# EAGLE design quad (EAGLE 8.3.2)

## Sheet 1 of 7
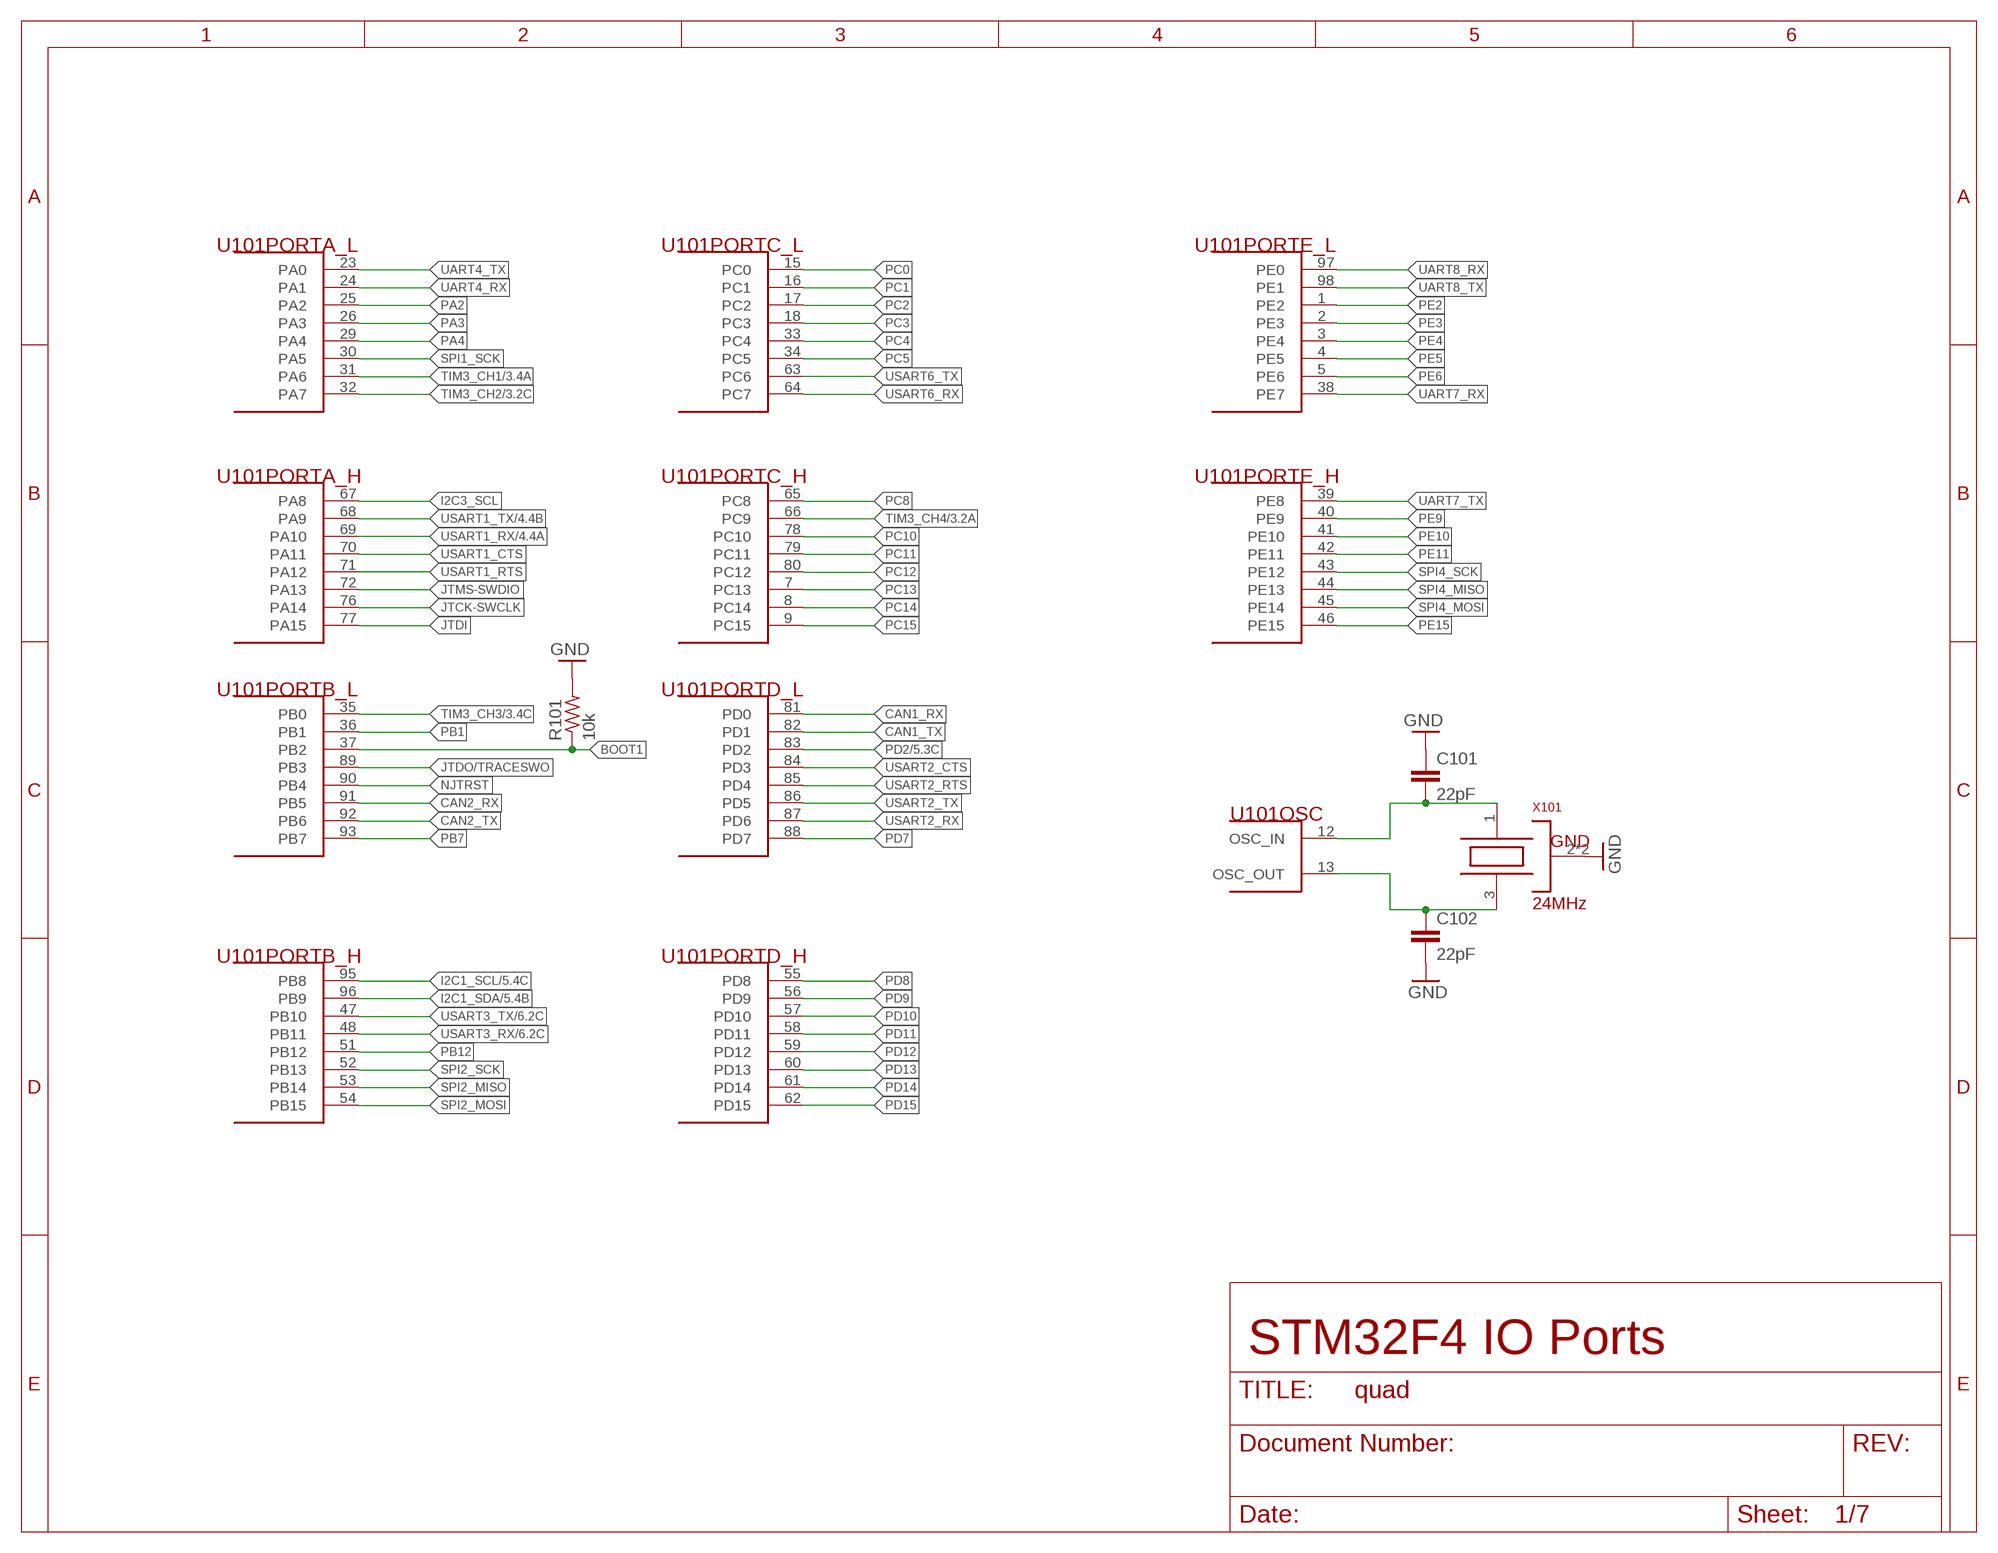
[diagram p0: schematic, sheet 1]

### Parts
C101  22pF  C-EUC0603  [C0603]
C102  22pF  C-EUC0603  [C0603]
R101  10k  R-US_R0603  [R0603]
U101  STM32F427VGT6  [LQFP-100]
X101  24MHz  OSCILLATOR  [OSC3.2X2.5]

### Nets
BOOT1: R101.1 U101.37(PORTB_L:PB2)
CAN1_RX: U101.81(PORTD_L:PD0)
CAN1_TX: U101.82(PORTD_L:PD1)
CAN2_RX: U101.91(PORTB_L:PB5)
CAN2_TX: U101.92(PORTB_L:PB6)
GND: C101.1 C102.2 R101.2 X101.2(GND) X101.4(GND) ; also sheet 2,3,4,5,6,7
I2C1_SCL: U101.95(PORTB_H:PB8) ; also sheet 5
I2C1_SDA: U101.96(PORTB_H:PB9) ; also sheet 5
I2C3_SCL: U101.67(PORTA_H:PA8)
JTCK-SWCLK: U101.76(PORTA_H:PA14)
JTDI: U101.77(PORTA_H:PA15)
JTDO/TRACESWO: U101.89(PORTB_L:PB3)
JTMS-SWDIO: U101.72(PORTA_H:PA13)
NJTRST: U101.90(PORTB_L:PB4)
OSC_IN: C101.2 U101.12(OSC:OSC_IN) X101.1(OSC1)
OSC_OUT: C102.1 U101.13(OSC:OSC_OUT) X101.3(OSC2)
PA2: U101.25(PORTA_L:PA2)
PA3: U101.26(PORTA_L:PA3)
PA4: U101.29(PORTA_L:PA4)
PB1: U101.36(PORTB_L:PB1)
PB7: U101.93(PORTB_L:PB7)
PB12: U101.51(PORTB_H:PB12)
PC0: U101.15(PORTC_L:PC0)
PC1: U101.16(PORTC_L:PC1)
PC2: U101.17(PORTC_L:PC2)
PC3: U101.18(PORTC_L:PC3)
PC4: U101.33(PORTC_L:PC4)
PC5: U101.34(PORTC_L:PC5)
PC8: U101.65(PORTC_H:PC8)
PC10: U101.78(PORTC_H:PC10)
PC11: U101.79(PORTC_H:PC11)
PC12: U101.80(PORTC_H:PC12)
PC13: U101.7(PORTC_H:PC13)
PC14: U101.8(PORTC_H:PC14)
PC15: U101.9(PORTC_H:PC15)
PD2: U101.83(PORTD_L:PD2) ; also sheet 5
PD7: U101.88(PORTD_L:PD7)
PD8: U101.55(PORTD_H:PD8)
PD9: U101.56(PORTD_H:PD9)
PD10: U101.57(PORTD_H:PD10)
PD11: U101.58(PORTD_H:PD11)
PD12: U101.59(PORTD_H:PD12)
PD13: U101.60(PORTD_H:PD13)
PD14: U101.61(PORTD_H:PD14)
PD15: U101.62(PORTD_H:PD15)
PE2: U101.1(PORTE_L:PE2)
PE3: U101.2(PORTE_L:PE3)
PE4: U101.3(PORTE_L:PE4)
PE5: U101.4(PORTE_L:PE5)
PE6: U101.5(PORTE_L:PE6)
PE9: U101.40(PORTE_H:PE9)
PE10: U101.41(PORTE_H:PE10)
PE11: U101.42(PORTE_H:PE11)
PE15: U101.46(PORTE_H:PE15)
SPI1_SCK: U101.30(PORTA_L:PA5)
SPI2_MISO: U101.53(PORTB_H:PB14)
SPI2_MOSI: U101.54(PORTB_H:PB15)
SPI2_SCK: U101.52(PORTB_H:PB13)
SPI4_MISO: U101.44(PORTE_H:PE13)
SPI4_MOSI: U101.45(PORTE_H:PE14)
SPI4_SCK: U101.43(PORTE_H:PE12)
TIM3_CH1: U101.31(PORTA_L:PA6) ; also sheet 3
TIM3_CH2: U101.32(PORTA_L:PA7) ; also sheet 3
TIM3_CH3: U101.35(PORTB_L:PB0) ; also sheet 3
TIM3_CH4: U101.66(PORTC_H:PC9) ; also sheet 3
UART4_RX: U101.24(PORTA_L:PA1)
UART4_TX: U101.23(PORTA_L:PA0)
UART7_RX: U101.38(PORTE_L:PE7)
UART7_TX: U101.39(PORTE_H:PE8)
UART8_RX: U101.97(PORTE_L:PE0)
UART8_TX: U101.98(PORTE_L:PE1)
USART1_CTS: U101.70(PORTA_H:PA11)
USART1_RTS: U101.71(PORTA_H:PA12)
USART1_RX: U101.69(PORTA_H:PA10) ; also sheet 4
USART1_TX: U101.68(PORTA_H:PA9) ; also sheet 4
USART2_CTS: U101.84(PORTD_L:PD3)
USART2_RTS: U101.85(PORTD_L:PD4)
USART2_RX: U101.87(PORTD_L:PD6)
USART2_TX: U101.86(PORTD_L:PD5)
USART3_RX: U101.48(PORTB_H:PB11) ; also sheet 6
USART3_TX: U101.47(PORTB_H:PB10) ; also sheet 6
USART6_RX: U101.64(PORTC_L:PC7)
USART6_TX: U101.63(PORTC_L:PC6)

### Notes on the sheet
- STM32F4 IO Ports

## Sheet 2 of 7
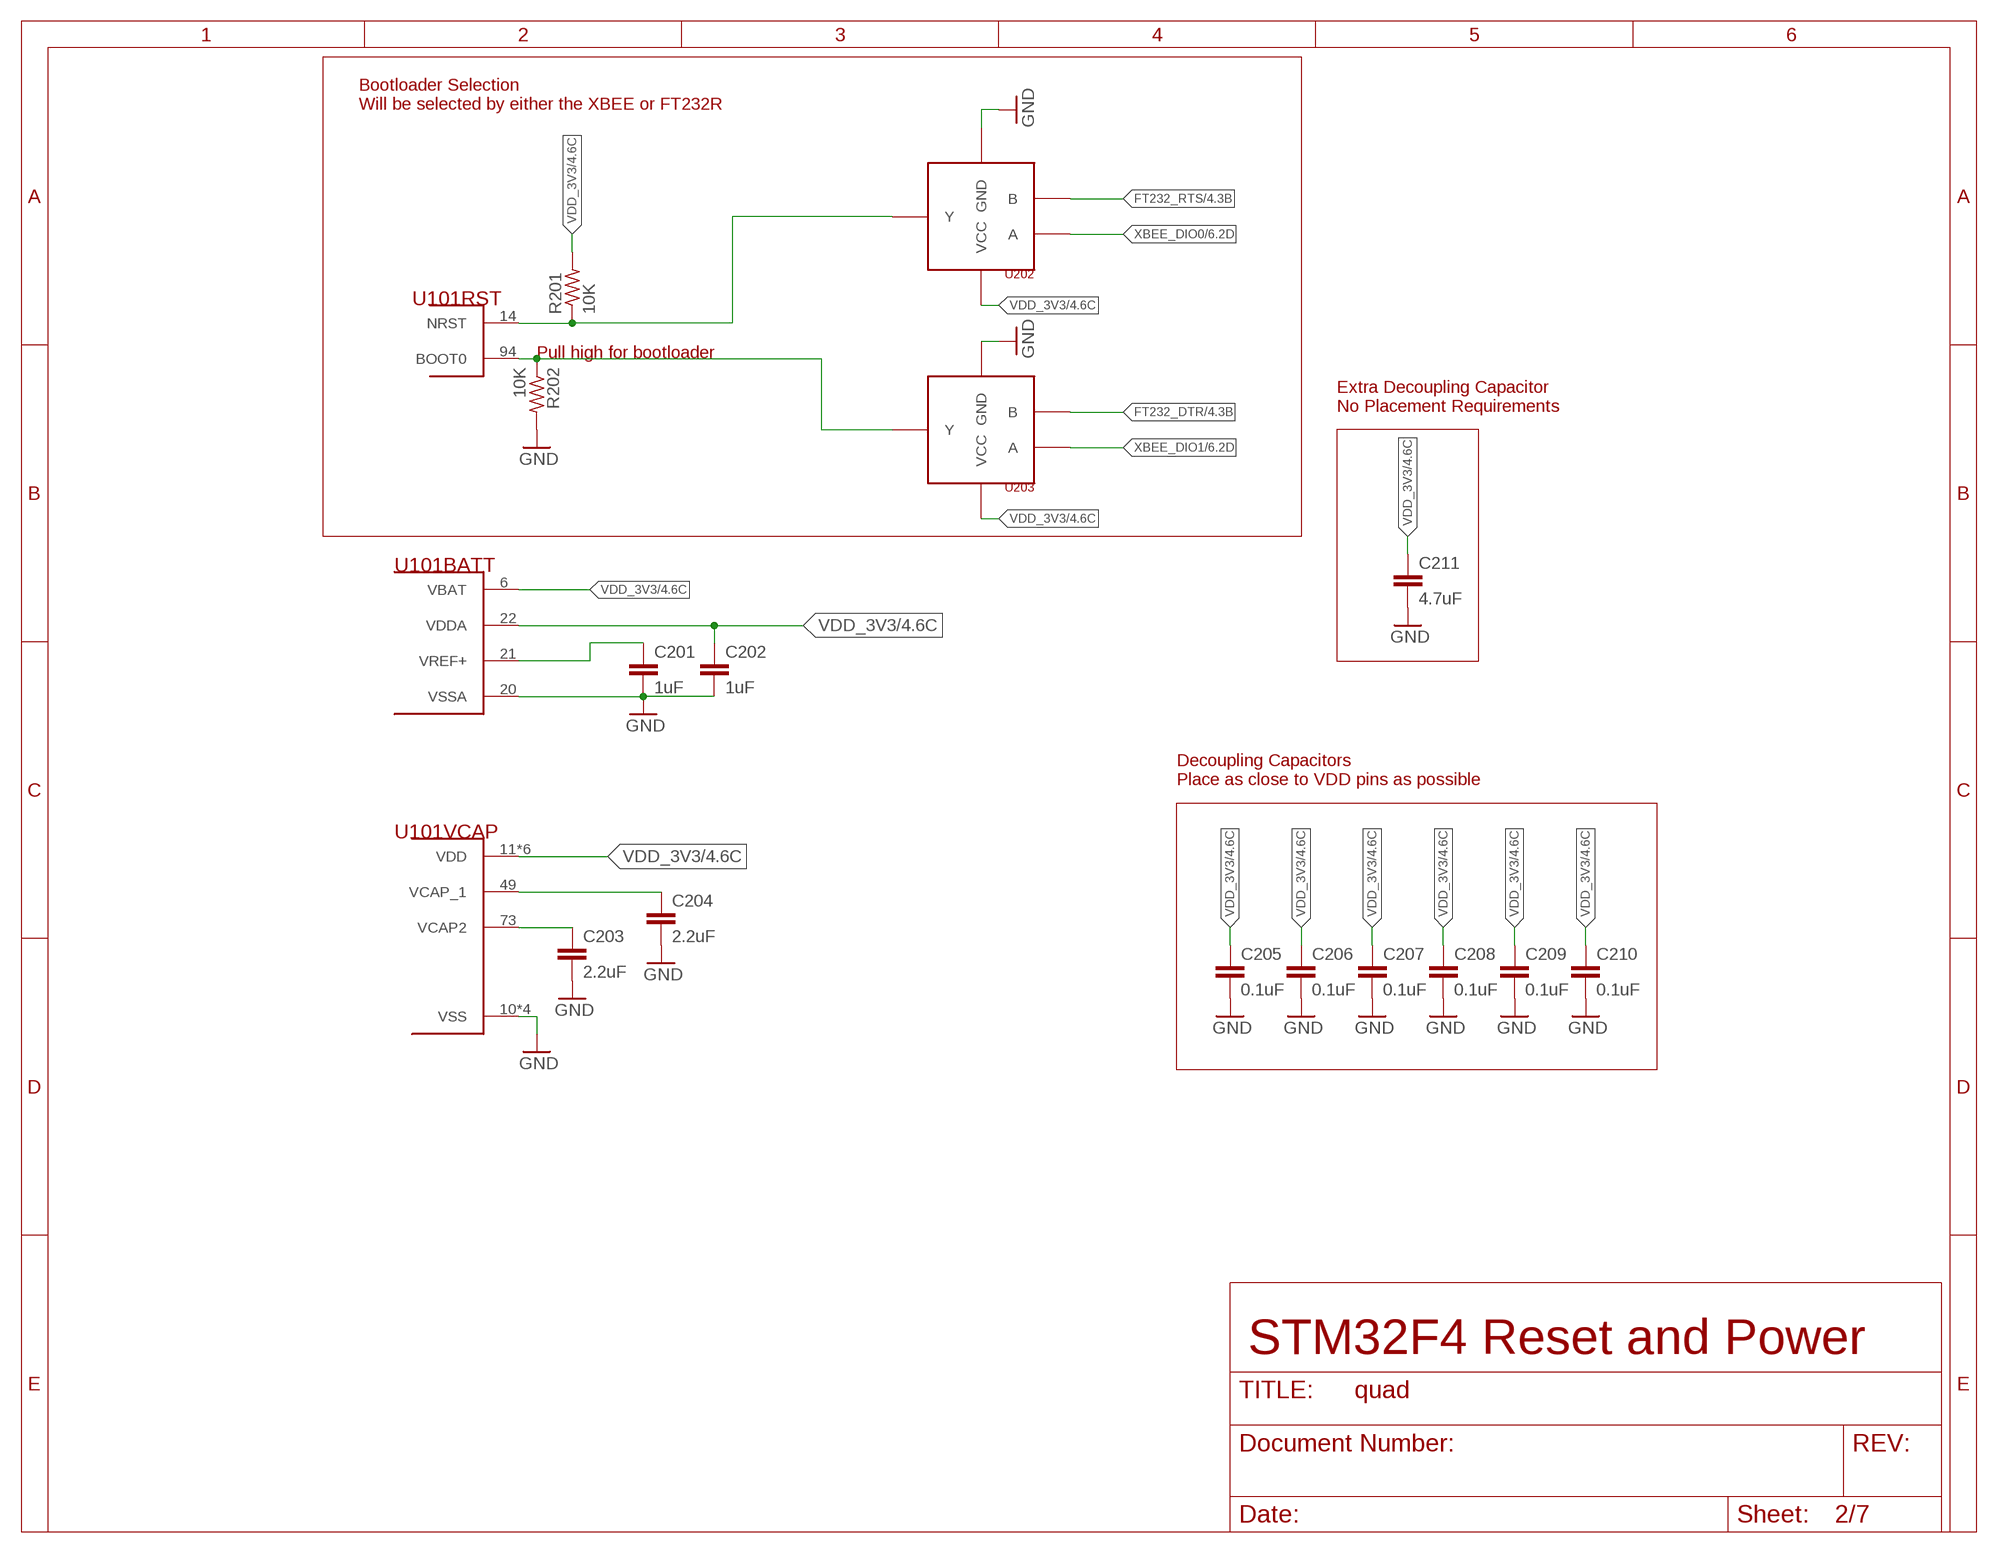
[diagram p1: schematic, sheet 2]

### Parts
C201  1uF  C-EUC0603  [C0603]
C202  1uF  C-EUC0603  [C0603]
C203  2.2uF  C-EUC0603  [C0603]
C204  2.2uF  C-EUC0603  [C0603]
C205  0.1uF  C-EUC0603  [C0603]
C206  0.1uF  C-EUC0603  [C0603]
C207  0.1uF  C-EUC0603  [C0603]
C208  0.1uF  C-EUC0603  [C0603]
C209  0.1uF  C-EUC0603  [C0603]
C210  0.1uF  C-EUC0603  [C0603]
C211  4.7uF  C-EUC0603  [C0603]
R201  10K  R-US_R0603  [R0603]
R202  10K  R-US_R0603  [R0603]
U202  AND_GATE  [SOT23-5L]
U203  SN74AHC1G32DBVR  [SOT23-5L]

### Nets
BOOT0: R202.1 U101.94(RST:BOOT0) U203.4(Y)
FT232_DTR: U203.2(B) ; also sheet 4
FT232_RTS: U202.2(B) ; also sheet 4
GND: C201.2 C202.2 C203.2 C204.2 C205.2 C206.2 C207.2 C208.2 C209.2 C210.2 C211.2 R202.2 U101.10(VCAP:VSS) U101.20(BATT:VSSA) U101.27(VCAP:VSS) U101.74(VCAP:VSS) U101.99(VCAP:VSS) U202.3(GND) U203.3(GND) ; also sheet 1,3,4,5,6,7
NRST: R201.1 U101.14(RST:NRST) U202.4(Y)
VCAP2: C203.1 U101.73(VCAP:VCAP2)
VCAP_1: C204.1 U101.49(VCAP:VCAP_1)
VDD_3V3: C201.1 C202.1 C205.1 C206.1 C207.1 C208.1 C209.1 C210.1 C211.1 R201.2 U101.6(BATT:VBAT) U101.11(VCAP:VDD) U101.19(VCAP:VDD) U101.21(BATT:VREF+) U101.22(BATT:VDDA) U101.28(VCAP:VDD) U101.50(VCAP:VDD) U101.75(VCAP:VDD) U101.100(VCAP:VDD) U202.5(VCC) U203.5(VCC) ; also sheet 4,5,6,7
XBEE_DIO0: U202.1(A) ; also sheet 6
XBEE_DIO1: U203.1(A) ; also sheet 6

### Notes on the sheet
- Bootloader Selection
  Will be selected by either the XBEE or FT232R
- Pull high for bootloader
- Extra Decoupling Capacitor
  No Placement Requirements
- Decoupling Capacitors
  Place as close to VDD pins as possible
- STM32F4 Reset and Power

## Sheet 3 of 7
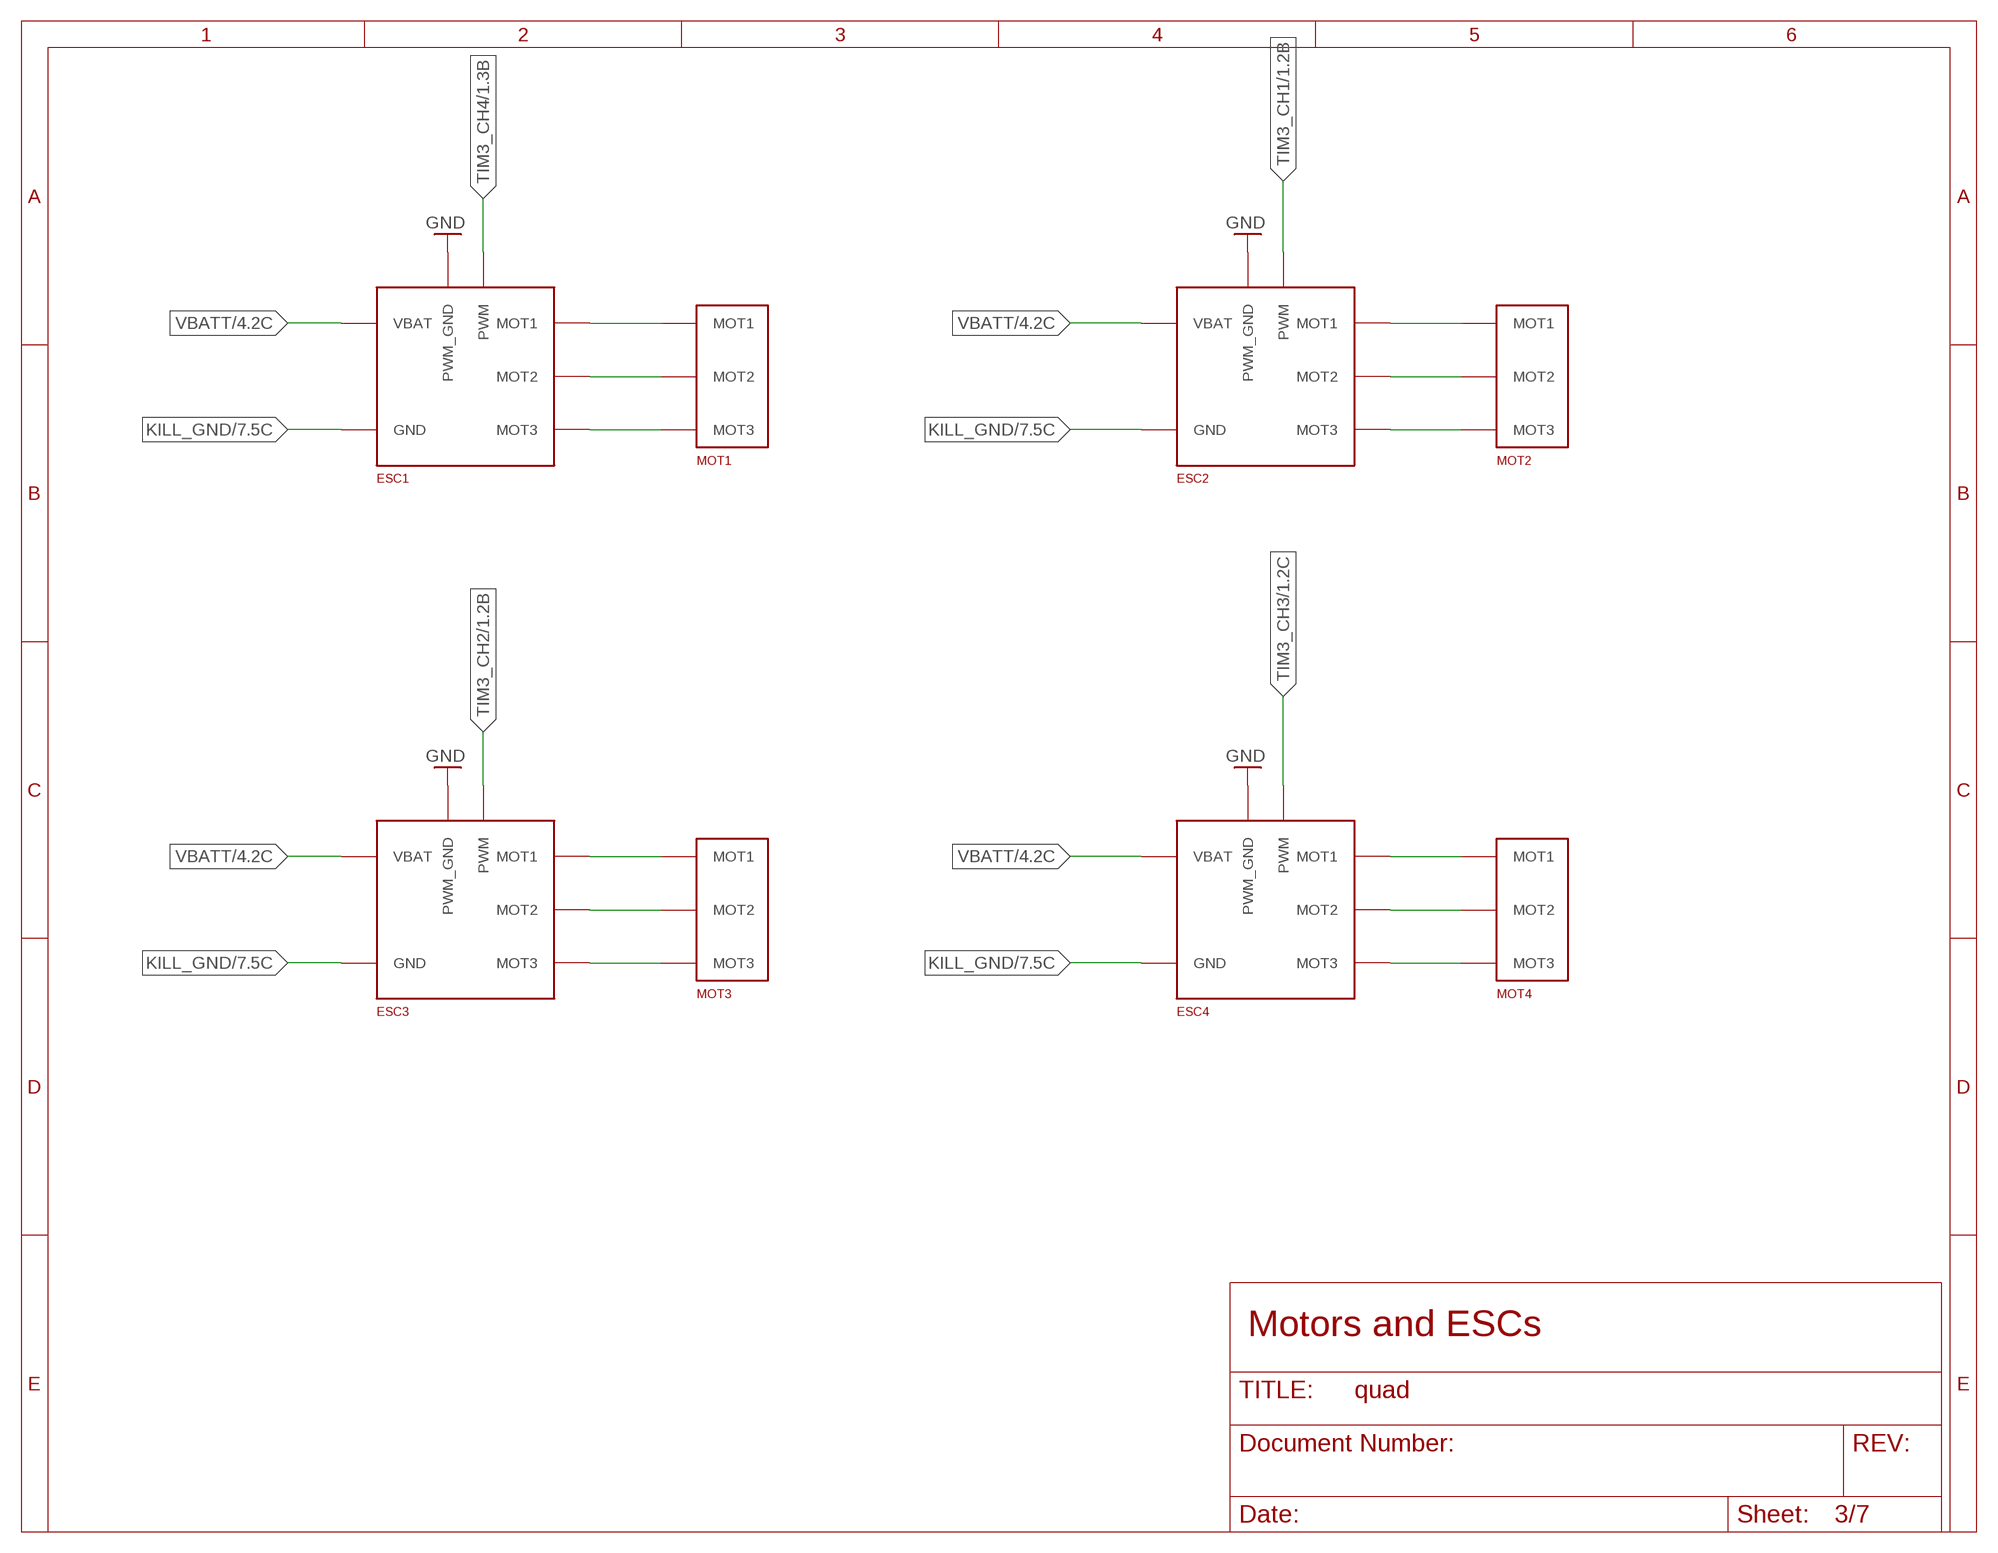
[diagram p2: schematic, sheet 3]

### Parts
ESC1  AFRO_ESC  [AFRO_ESC]
ESC2  AFRO_ESC  [AFRO_ESC]
ESC3  AFRO_ESC  [AFRO_ESC]
ESC4  AFRO_ESC  [AFRO_ESC]
MOT1  MOTOR  [MOTOR]
MOT2  MOTOR  [MOTOR]
MOT3  MOTOR  [MOTOR]
MOT4  MOTOR  [MOTOR]

### Nets
GND: ESC1.PWM_GND ESC2.PWM_GND ESC3.PWM_GND ESC4.PWM_GND ; also sheet 1,2,4,5,6,7
KILL_GND: ESC1.GND ESC2.GND ESC3.GND ESC4.GND ; also sheet 7
MOT1_1: ESC1.MOT1 MOT1.MOT1
MOT1_2: ESC1.MOT2 MOT1.MOT2
MOT1_3: ESC1.MOT3 MOT1.MOT3
MOT2_1: ESC2.MOT1 MOT2.MOT1
MOT_2_2: ESC2.MOT2 MOT2.MOT2
MOT_2_3: ESC2.MOT3 MOT2.MOT3
MOT_3_1: ESC3.MOT1 MOT3.MOT1
MOT_3_2: ESC3.MOT2 MOT3.MOT2
MOT_3_3: ESC3.MOT3 MOT3.MOT3
MOT_4_1: ESC4.MOT1 MOT4.MOT1
MOT_4_2: ESC4.MOT2 MOT4.MOT2
MOT_4_3: ESC4.MOT3 MOT4.MOT3
TIM3_CH1: ESC2.PWM ; also sheet 1
TIM3_CH2: ESC3.PWM ; also sheet 1
TIM3_CH3: ESC4.PWM ; also sheet 1
TIM3_CH4: ESC1.PWM ; also sheet 1
VBATT: ESC1.VBATT(VBAT) ESC2.VBATT(VBAT) ESC3.VBATT(VBAT) ESC4.VBATT(VBAT) ; also sheet 4,7

### Notes on the sheet
- Motors and ESCs

## Sheet 4 of 7
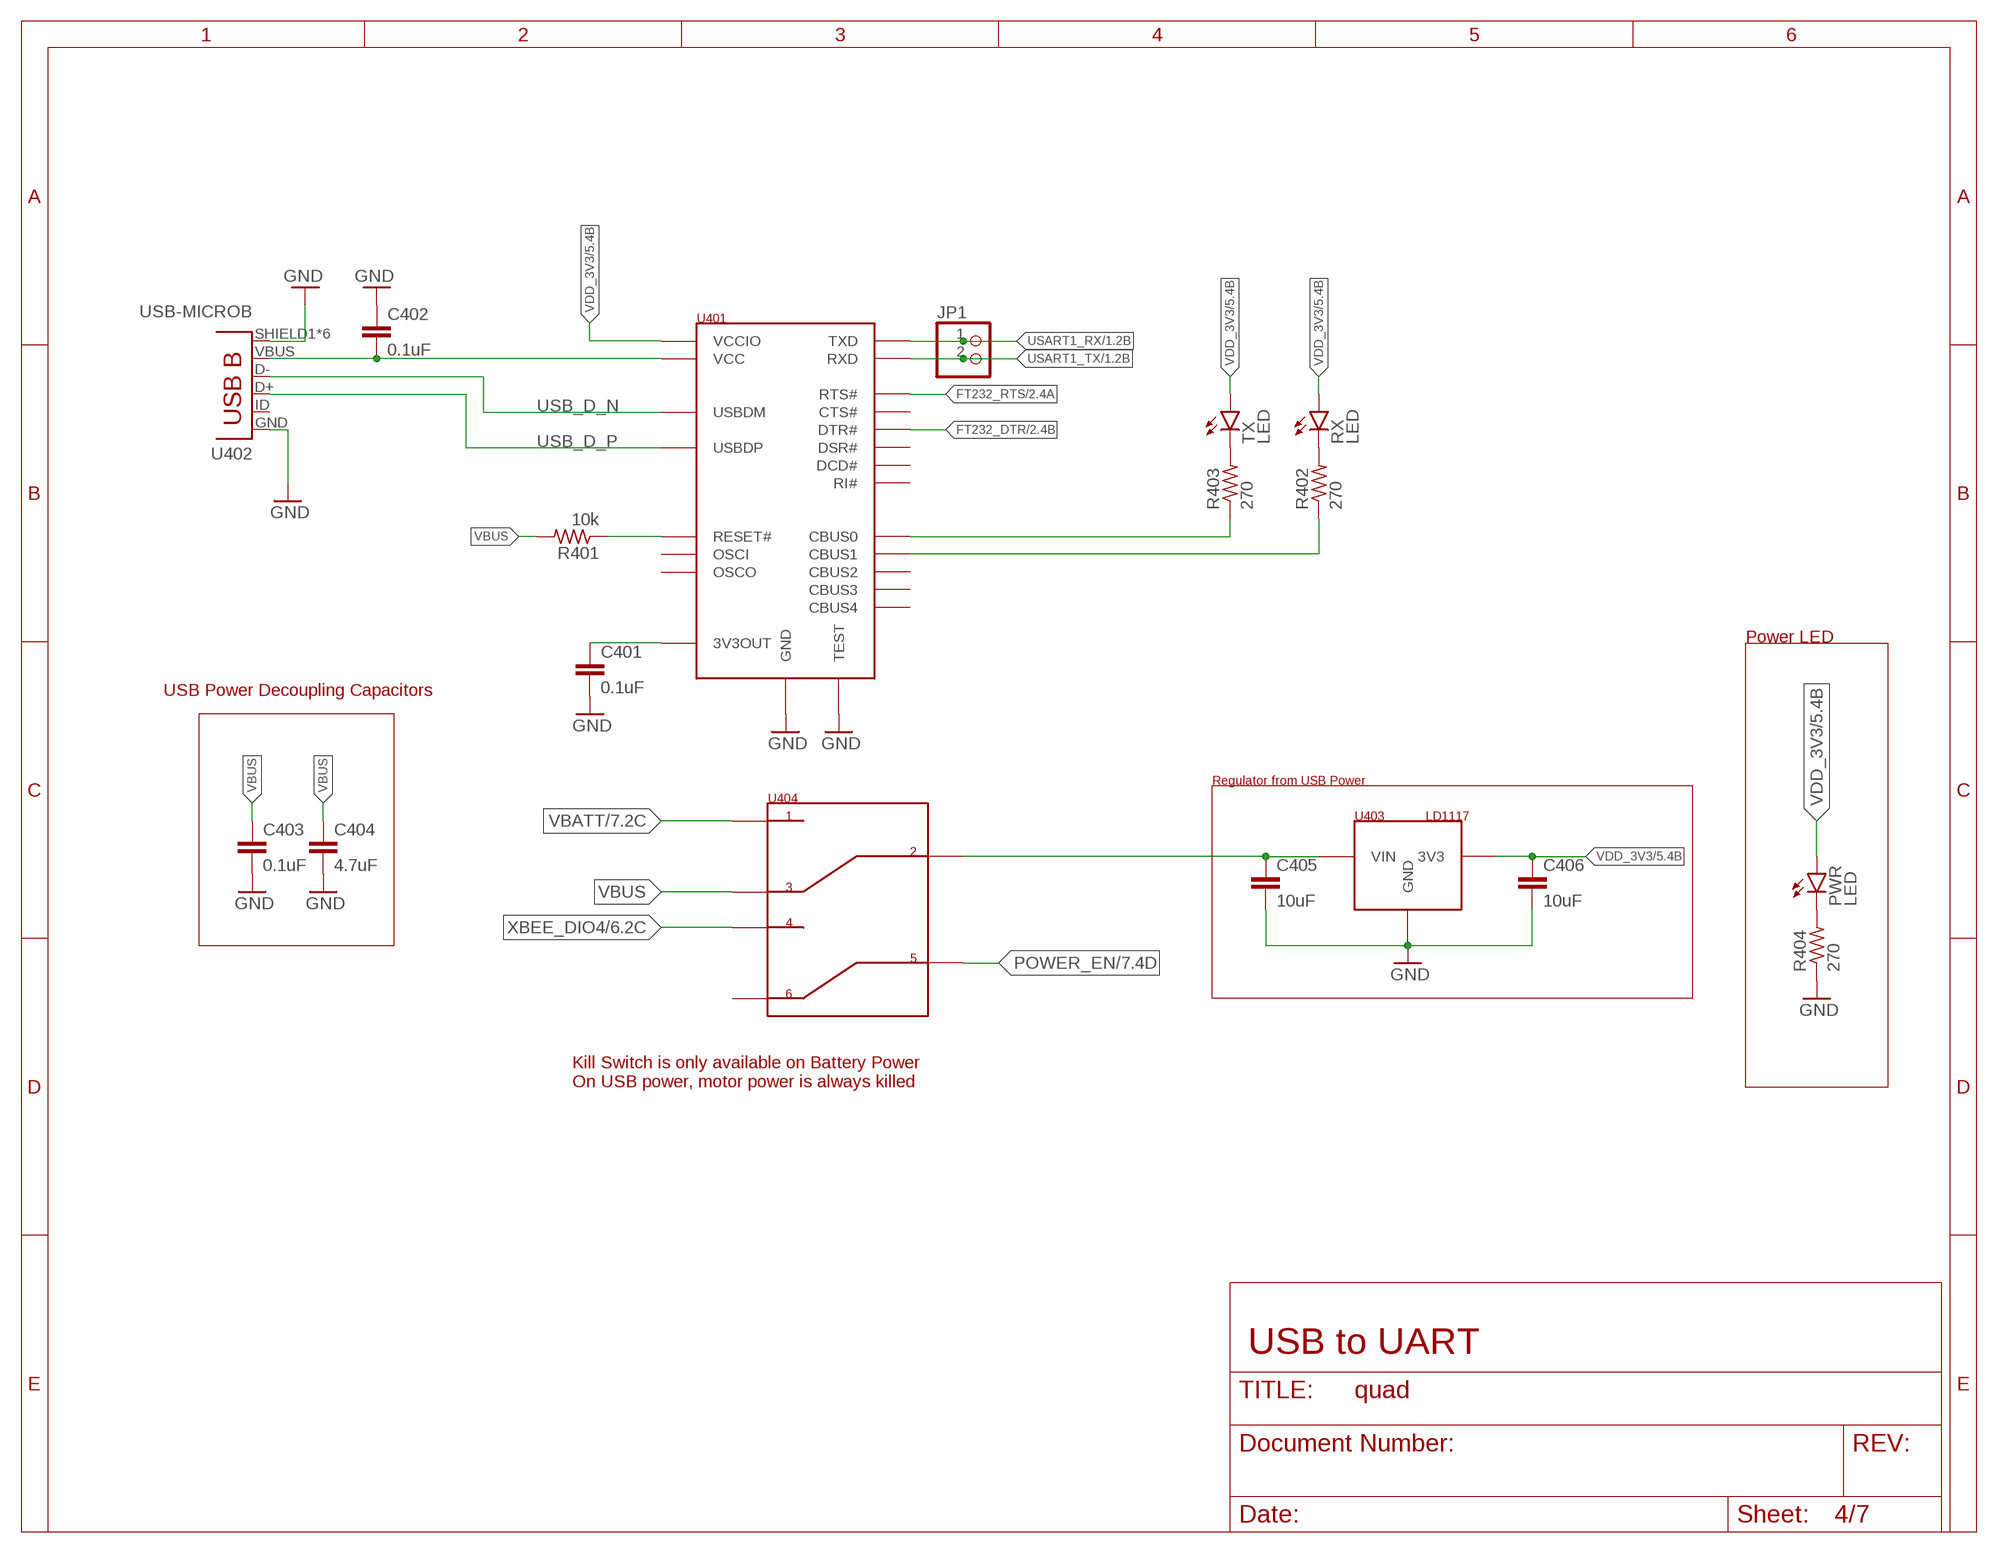
[diagram p3: schematic, sheet 4]

### Parts
C401  0.1uF  C-EUC0603  [C0603]
C402  0.1uF  C-EUC0603  [C0603]
C403  0.1uF  C-EUC0603  [C0603]
C404  4.7uF  C-EUC0603  [C0603]
C405  10uF  C-EUC0603  [C0603]
C406  10uF  C-EUC0603  [C0603]
JP1  PINHD-1X2  [1X02]
PWR  LED  [LED-0603]
R401  10k  R-US_R0603  [R0603]
R402  270  R-US_R0603  [R0603]
R403  270  R-US_R0603  [R0603]
R404  270  R-US_R0603  [R0603]
RX  LED  [LED-0603]
TX  LED  [LED-0603]
U401  FT232R  [SSOP28]
U402  USB-MICROB  [USB-B-MICRO-SMD]
U403  LD1117  [SOT223]
U404  MFS201N-16-Z  [MFS201N-16-Z]

### Nets
FT232_DTR: U401.2(DTR#) ; also sheet 2
FT232_RTS: U401.3(RTS#) ; also sheet 2
GND: C401.2 C402.1 C403.2 C404.2 C405.2 C406.2 R404.1 U401.7(GND) U401.18(GND) U401.21(GND) U401.25(GND) U401.26(TEST) U402.GND U402.SHIELD1(SHIELD) U402.SHIELD2(SHIELD) U402.SHIELD3(SHIELD) U402.SHIELD4(SHIELD) U402.SHIELD5(SHIELD) U402.SHIELD6(SHIELD) U403.1(GND) ; also sheet 1,2,3,5,6,7
N$2: R401.1 U401.19(RESET#)
N$5: C401.1 U401.17(3V3OUT)
N$8: R403.1 U401.23(CBUS0)
N$9: R402.1 U401.22(CBUS1)
N$10: R402.2 RX.C
N$11: R403.2 TX.C
N$18: PWR.C R404.2
POWER_EN: U404.5 ; also sheet 7
PWR: C405.1 U403.3(VIN) U404.2
USART1_RX: JP1.1 U401.1(TXD) ; also sheet 1
USART1_TX: JP1.2 U401.5(RXD) ; also sheet 1
USB_D_N [diff pair]: U401.16(USBDM) U402.D-
USB_D_P [diff pair]: U401.15(USBDP) U402.D+
VBATT: U404.1 ; also sheet 3,7
VBUS: C402.2 C403.1 C404.1 R401.2 U401.20(VCC) U402.VBUS U404.3
VDD_3V3: C406.1 PWR.A RX.A TX.A U401.4(VCCIO) U403.2(3V3) U403.4(3V3) ; also sheet 2,5,6,7
XBEE_DIO4: U404.4 ; also sheet 6
Unconnected: U401.6(RI#) U401.9(DSR#) U401.10(DCD#) U401.11(CTS#) U401.12(CBUS4) U401.13(CBUS2) U401.14(CBUS3) U401.27(OSCI) U401.28(OSCO) U402.ID(USBID) U404.6

### Notes on the sheet
- Power LED
- USB Power Decoupling Capacitors
- Regulator from USB Power
- Kill Switch is only available on Battery Power
  On USB power, motor power is always killed
- USB to UART

## Sheet 5 of 7
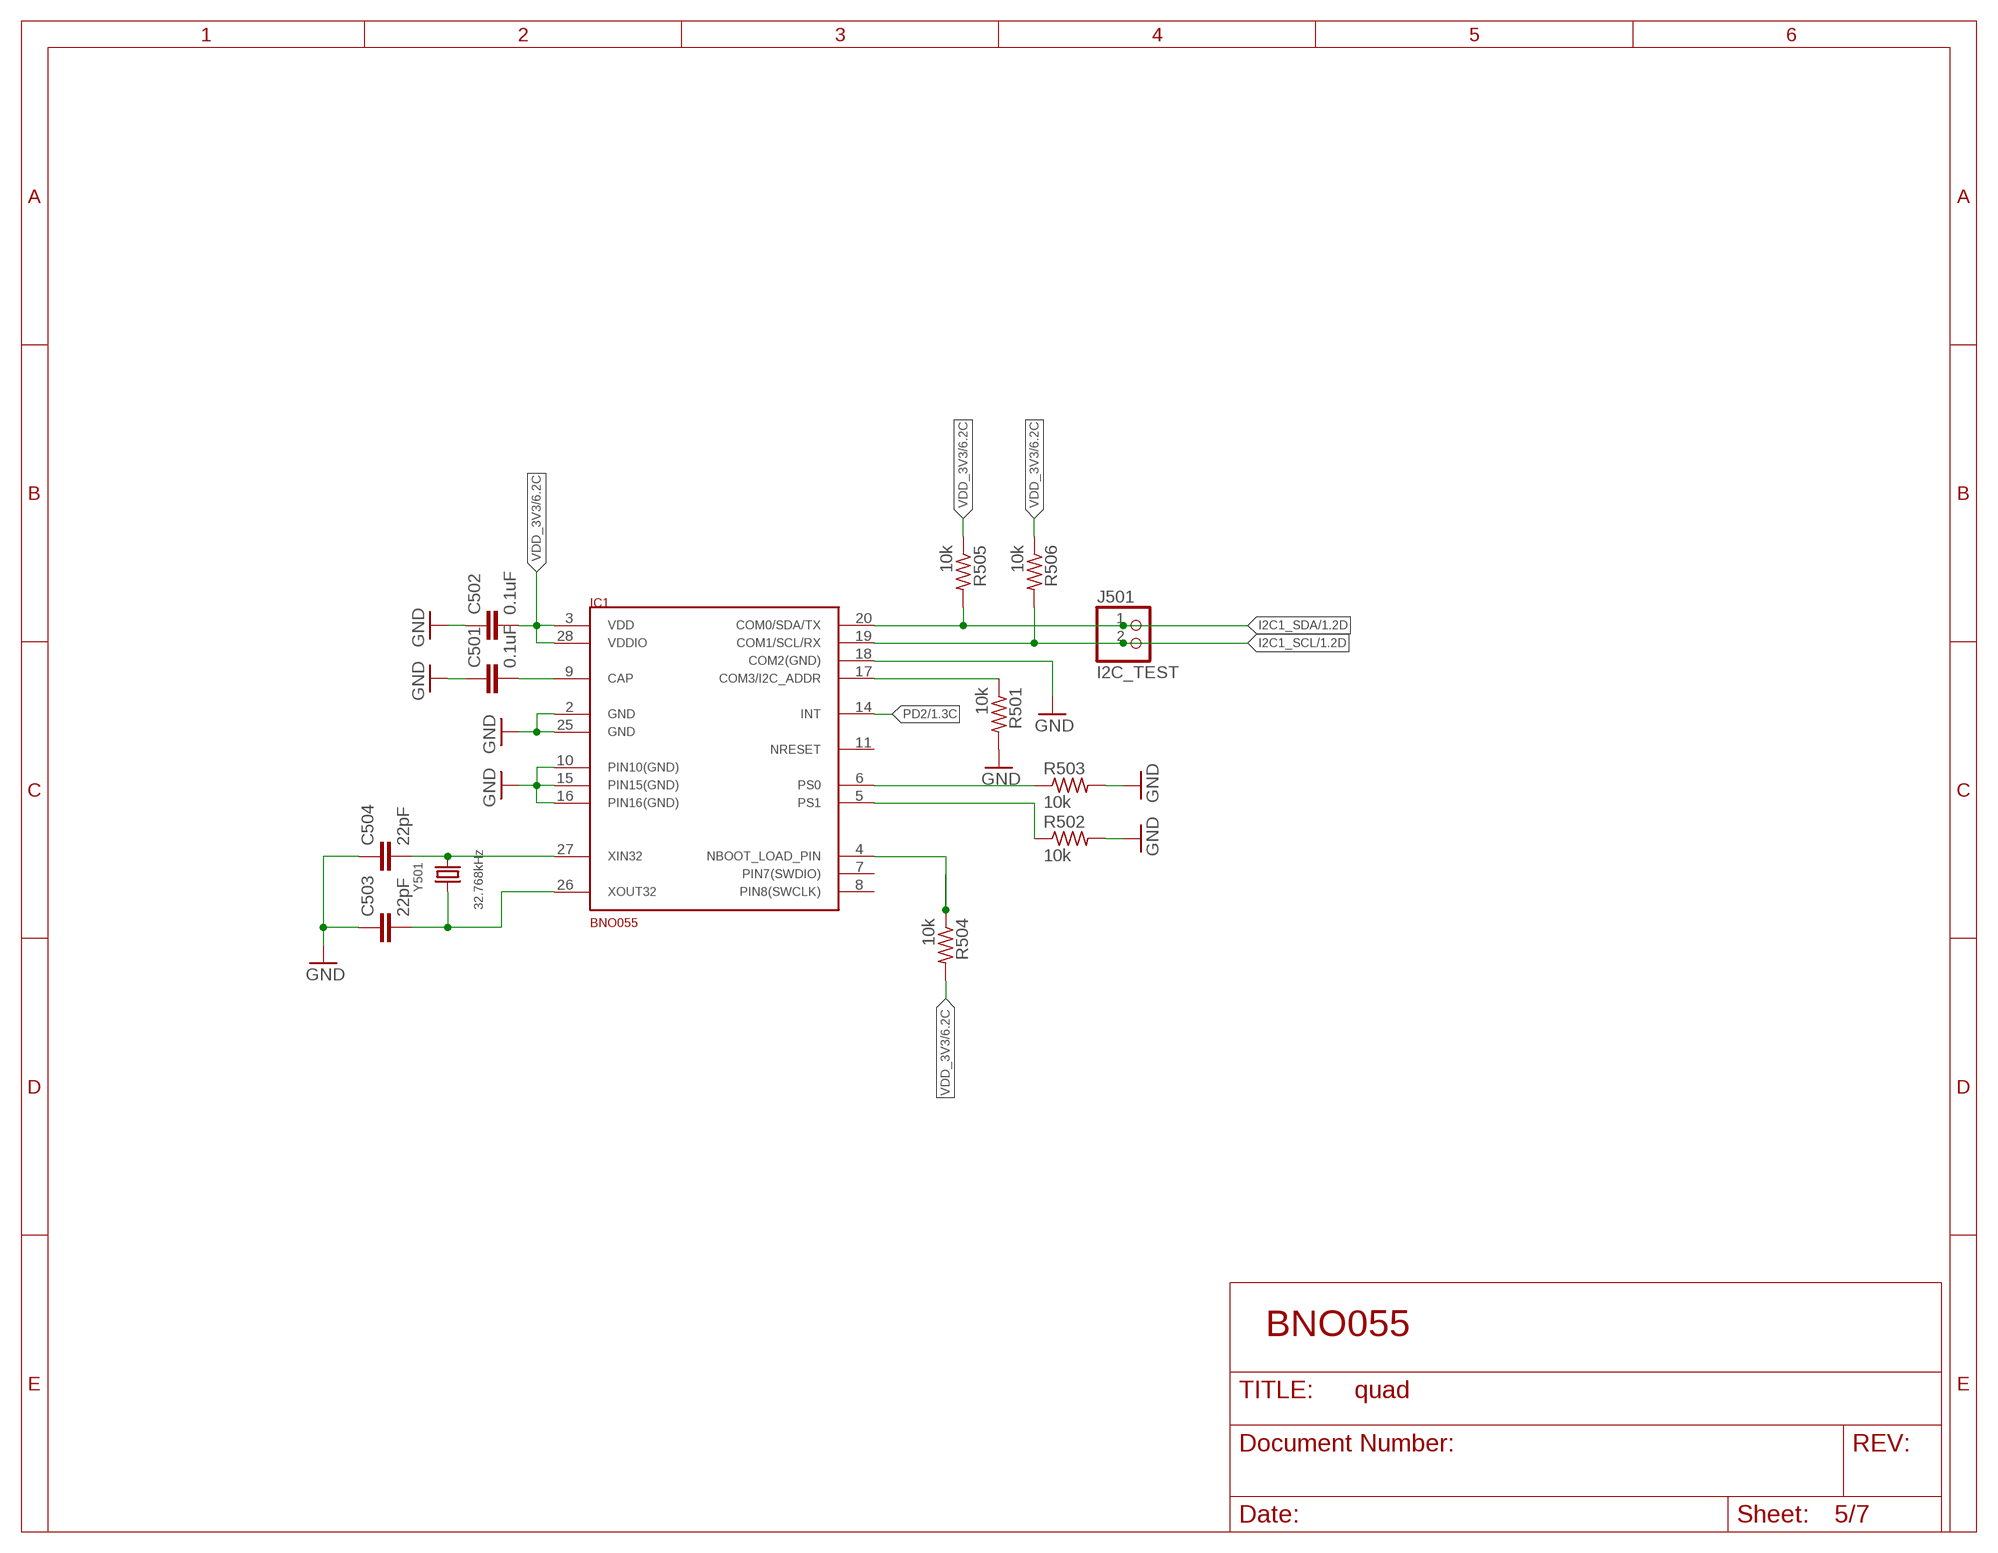
[diagram p4: schematic, sheet 5]

### Parts
C501  0.1uF  C-EUC0603  [C0603]
C502  0.1uF  C-EUC0603  [C0603]
C503  22pF  C-EUC0603  [C0603]
C504  22pF  C-EUC0603  [C0603]
IC1  BNO055  [LGA-28_3.80X5.20/0.5]
J501  I2C_TEST  PINHD-1X2  [1X02]
R501  10k  R-US_R0603  [R0603]
R502  10k  R-US_R0603  [R0603]
R503  10k  R-US_R0603  [R0603]
R504  10k  R-US_R0603  [R0603]
R505  10k  R-US_R0603  [R0603]
R506  10k  R-US_R0603  [R0603]
Y501  32.768kHz  CRYSTAL  [ABS25]

### Nets
GND: C501.1 C502.1 C503.1 C504.1 IC1.2 IC1.10 IC1.15 IC1.16 IC1.18 IC1.25 R501.2 R502.2 R503.2 ; also sheet 1,2,3,4,6,7
I2C1_SCL: IC1.19 J501.2 R506.2 ; also sheet 1
I2C1_SDA: IC1.20 J501.1 R505.2 ; also sheet 1
N$4: C501.2 IC1.9
N$6: C504.2 IC1.27 Y501.4
N$7: C503.2 IC1.26 Y501.1
N$12: IC1.17 R501.1
N$14: IC1.6 R503.1
N$15: IC1.5 R502.1
N$16: IC1.4 R504.1
PD2: IC1.14 ; also sheet 1
VDD_3V3: C502.2 IC1.3 IC1.28 R504.2 R505.1 R506.1 ; also sheet 2,4,6,7
Unconnected: IC1.7 IC1.8 IC1.11

### Notes on the sheet
- BNO055

## Sheet 6 of 7
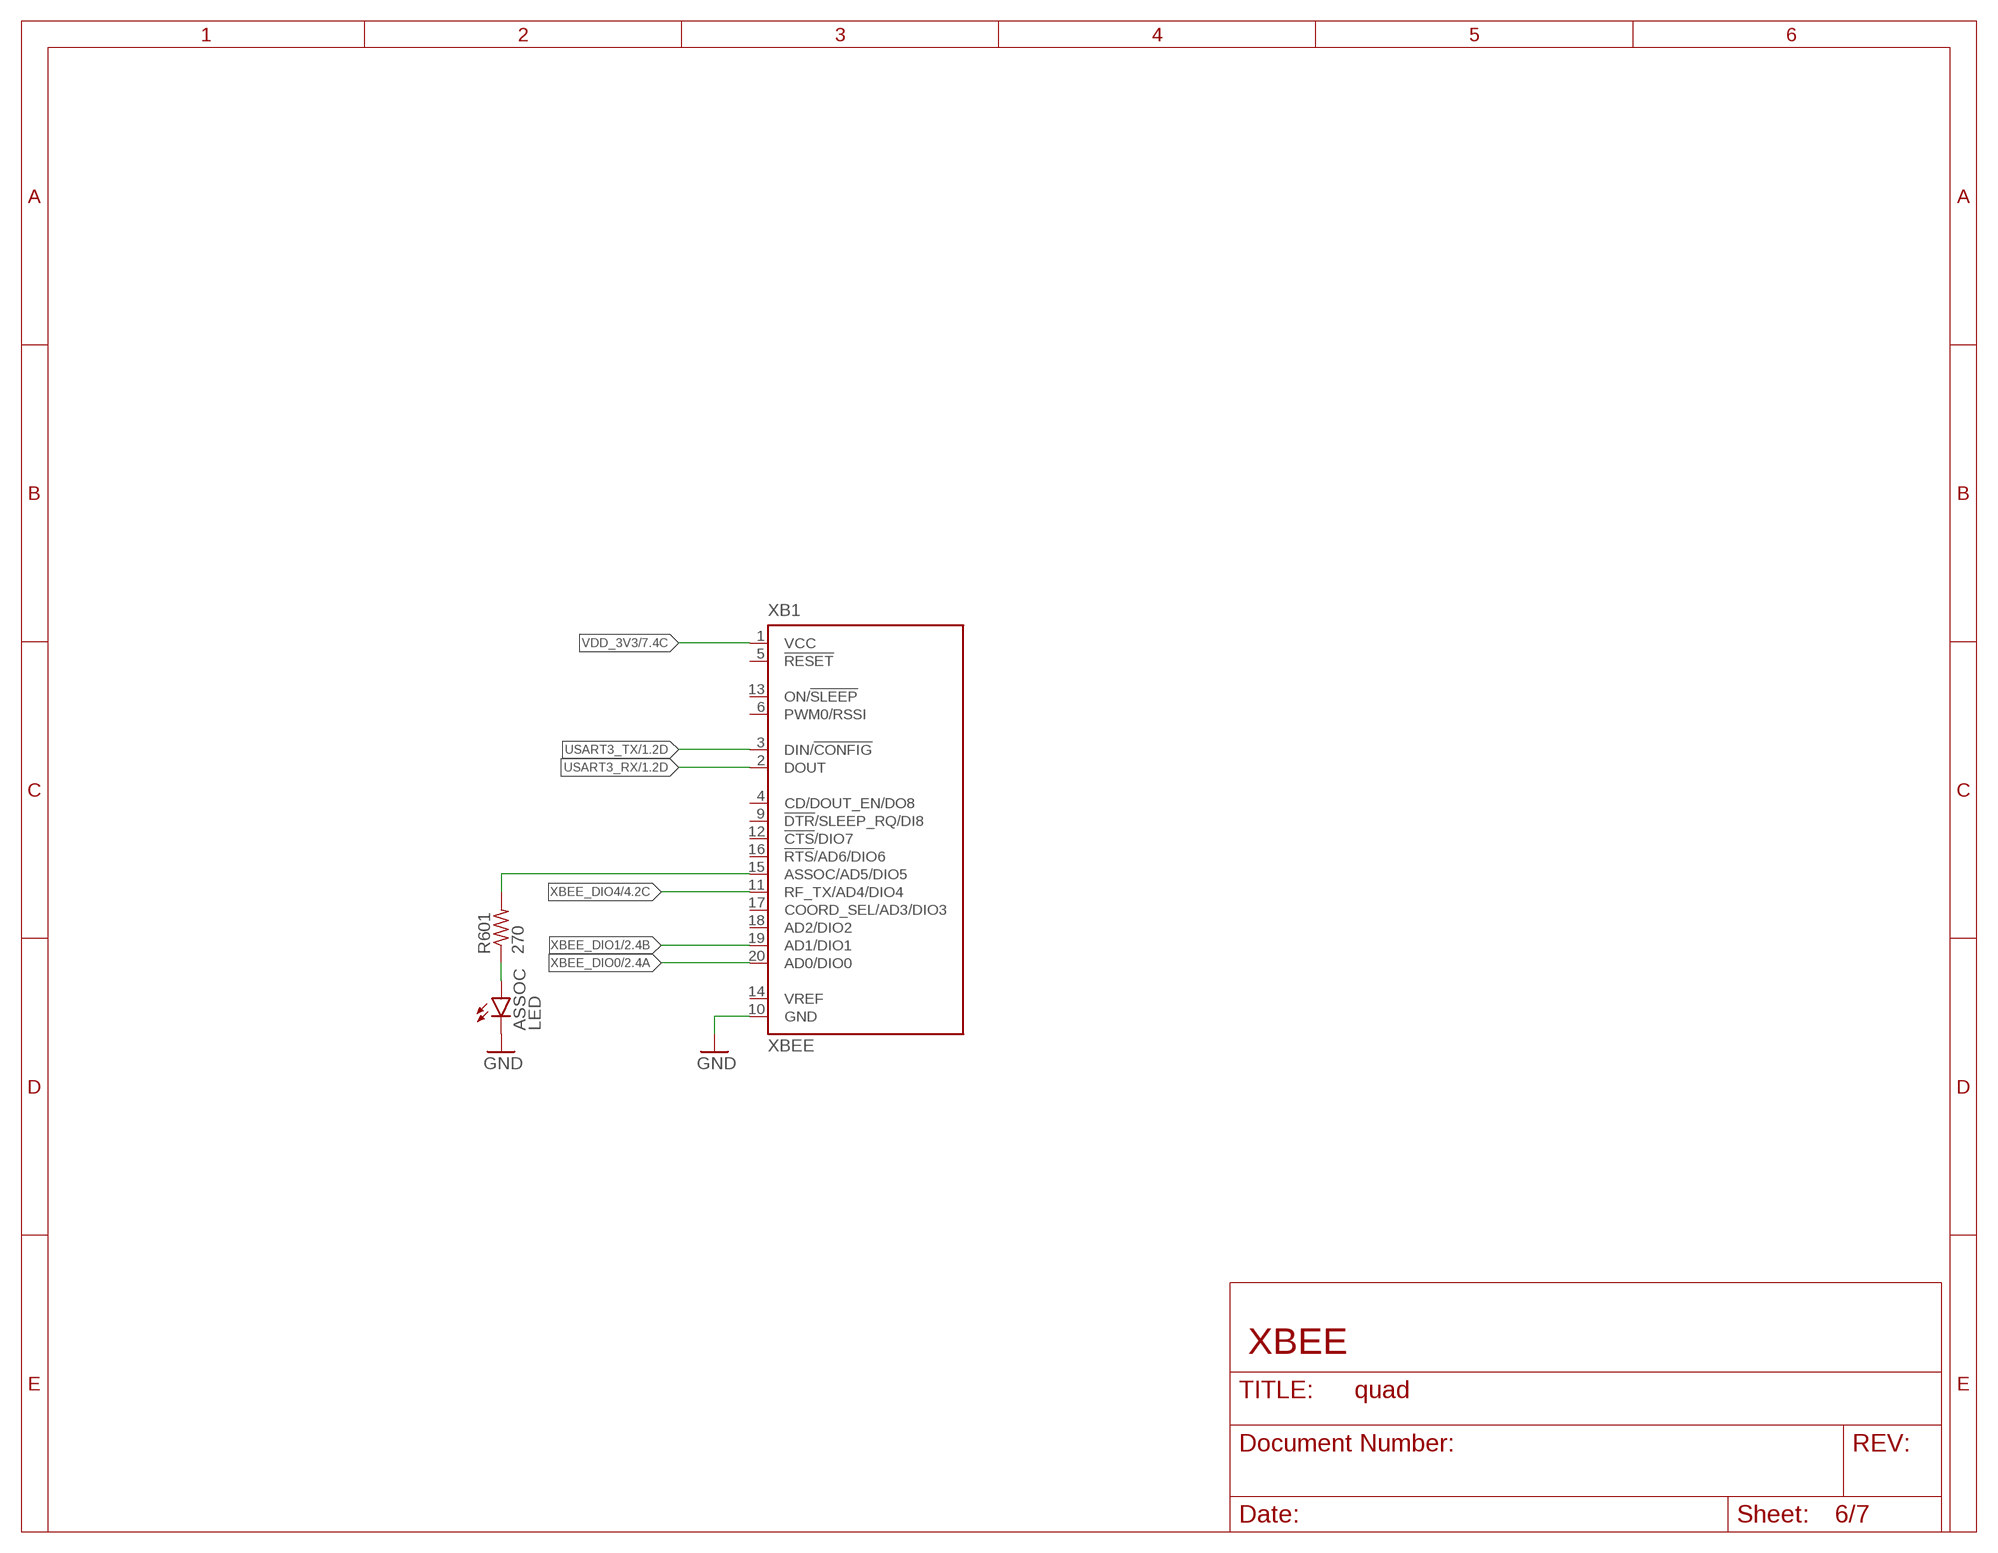
[diagram p5: schematic, sheet 6]

### Parts
ASSOC  LED  [LED-0603]
R601  270  R-US_R0603  [R0603]
XB1  XBEE  [XBEE]

### Nets
GND: ASSOC.C XB1.10(GND) ; also sheet 1,2,3,4,5,7
N$3: ASSOC.A R601.1
N$17: R601.2 XB1.15(ASSOC/AD5/DIO5)
USART3_RX: XB1.2(DOUT) ; also sheet 1
USART3_TX: XB1.3(DIN/!CONFIG) ; also sheet 1
VDD_3V3: XB1.1(VCC) ; also sheet 2,4,5,7
XBEE_DIO0: XB1.20(AD0/DIO0) ; also sheet 2
XBEE_DIO1: XB1.19(AD1/DIO1) ; also sheet 2
XBEE_DIO4: XB1.11(RF_TX/AD4/DIO4) ; also sheet 4
Unconnected: XB1.4(CD/DOUT_EN/DO8) XB1.5(!RESET) XB1.6(PWM0/RSSI) XB1.9(!DTR!/SLEEP_RQ/DI8) XB1.12(!CTS!/DIO7) XB1.13(ON/!SLEEP) XB1.14(VREF) XB1.16(!RTS!/AD6/DIO6) XB1.17(COORD_SEL/AD3/DIO3) XB1.18(AD2/DIO2)

### Notes on the sheet
- XBEE

## Sheet 7 of 7
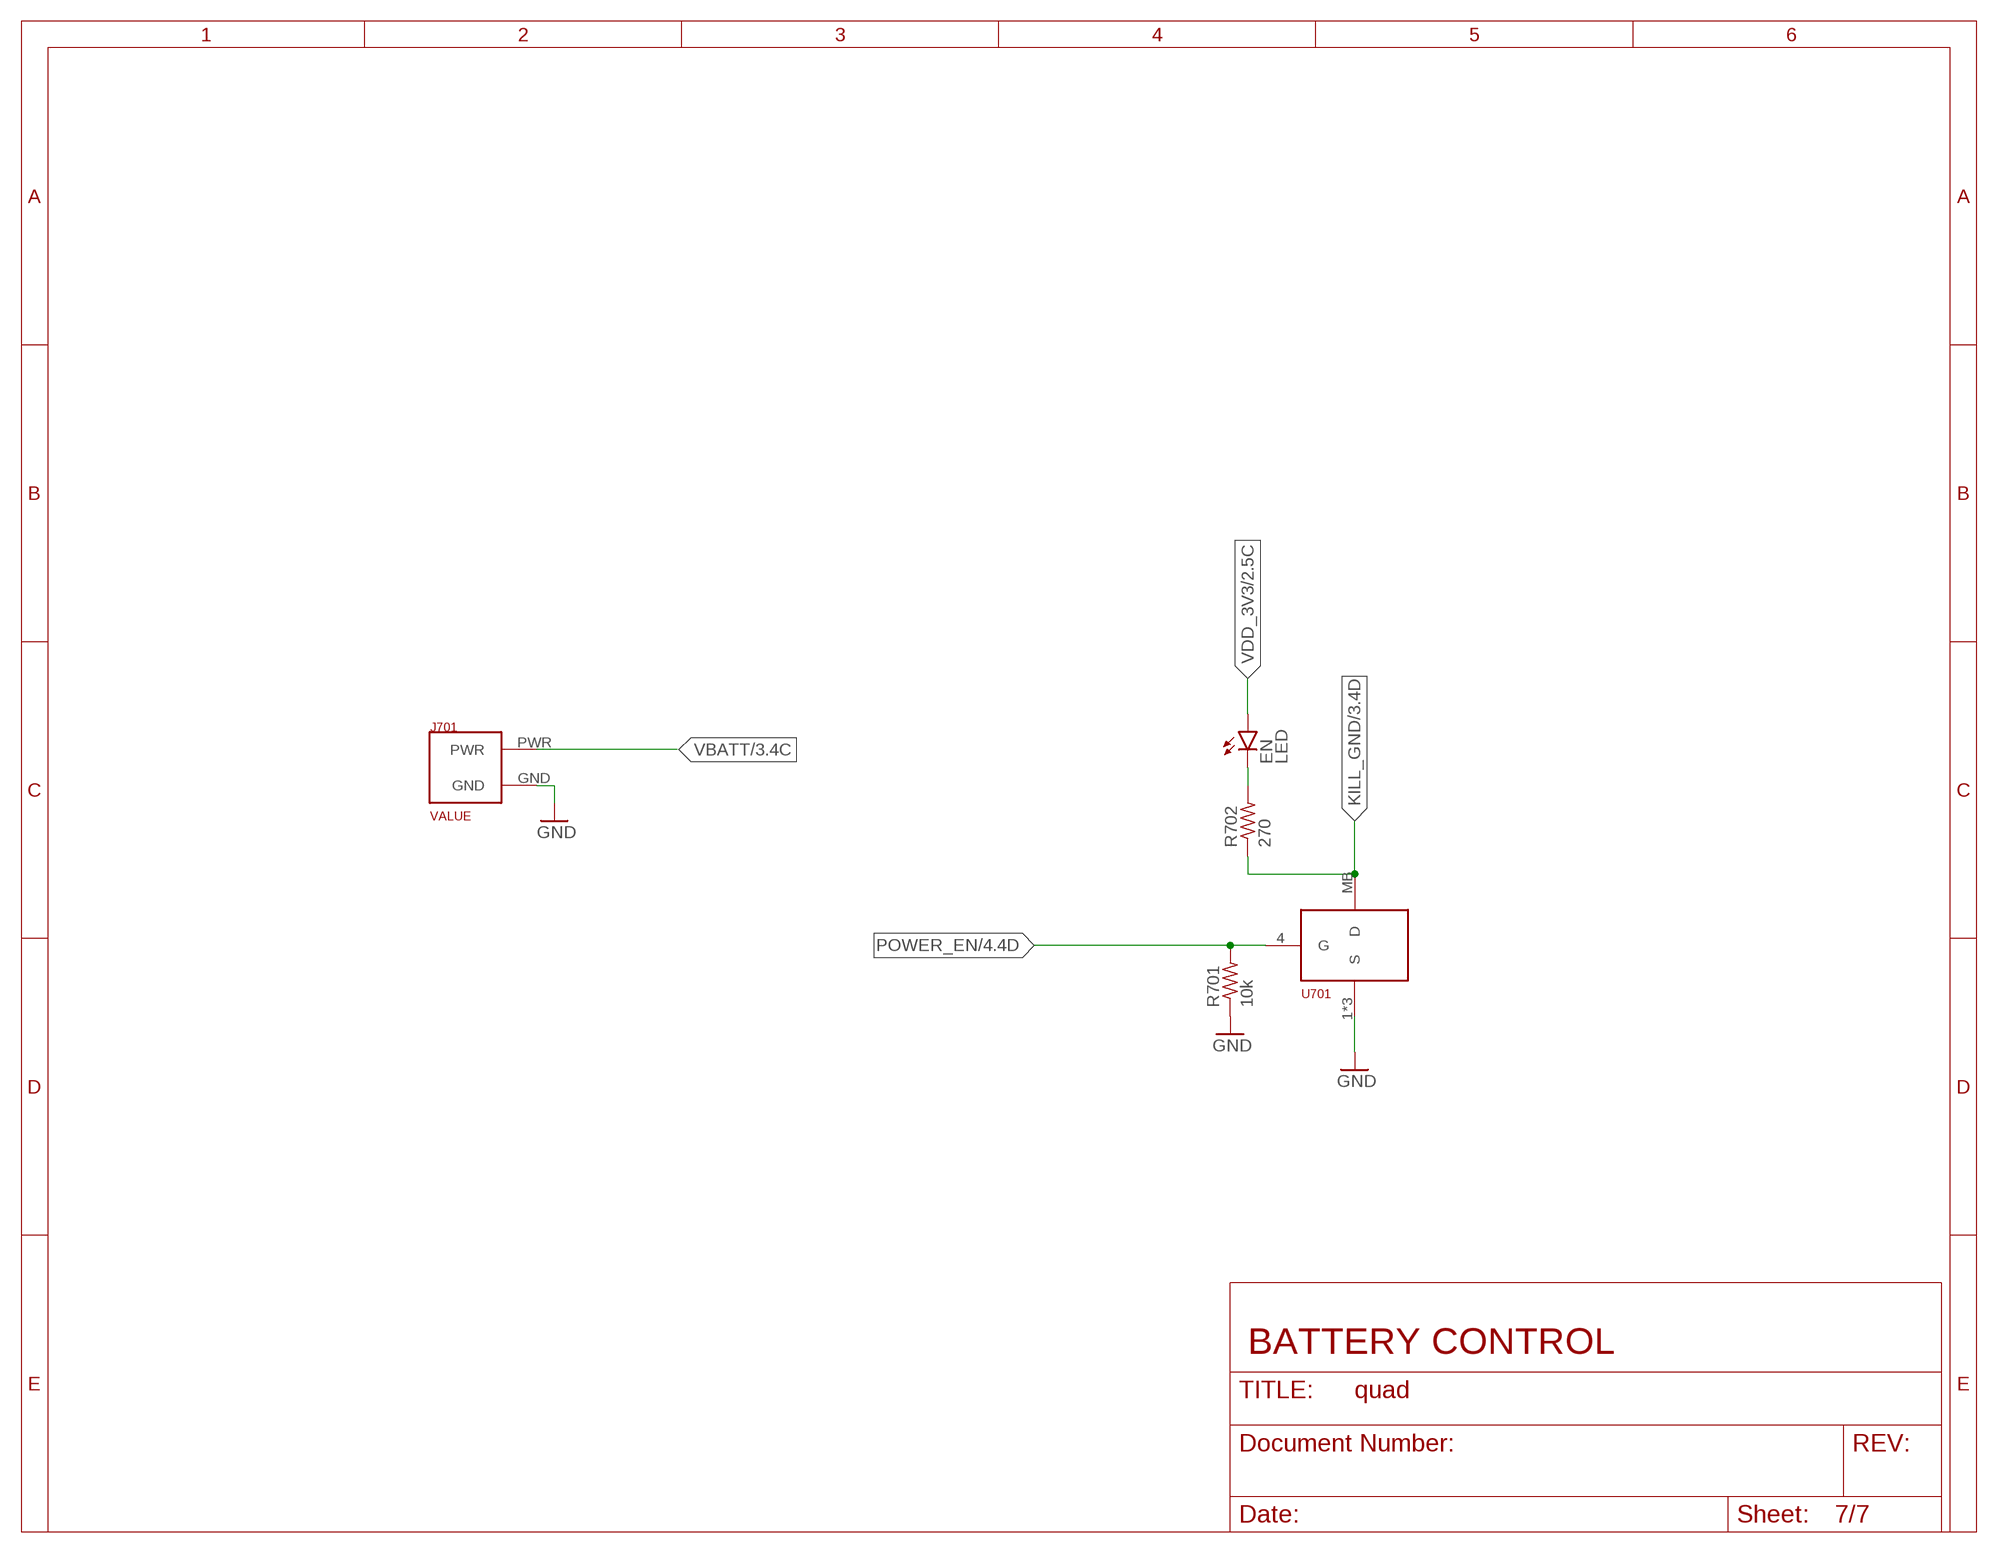
[diagram p6: schematic, sheet 7]

### Parts
EN  LED  [LED-0603]
J701  XT60  [XT60]
R701  10k  R-US_R0603  [R0603]
R702  270  R-US_R0603  [R0603]
U701  PSMN9RS-30YLC  [SOT669]

### Nets
GND: J701.GND R701.1 U701.1(S) U701.2(S) U701.3(S) ; also sheet 1,2,3,4,5,6
KILL_GND: R702.1 U701.MB(D) ; also sheet 3
N$19: EN.C R702.2
POWER_EN: R701.2 U701.4(G) ; also sheet 4
VBATT: J701.PWR ; also sheet 3,4
VDD_3V3: EN.A ; also sheet 2,4,5,6

### Notes on the sheet
- BATTERY CONTROL

## Library data of the parts
ASSOC EN PWR RX TX = quad:LED
C101 C102 C201-C211 C401-C406 C501-C504 = quad:C-EU: CAPACITOR, European symbol
ESC1-ESC4 = quad:AFRO_ESC
IC1 = quad:BNO055
J501 JP1 = quad:PINHD-1X2: PIN HEADER
J701 = quad:XT60
MOT1-MOT4 = quad:MOTOR
R101 R201 R202 R401-R404 R501-R506 R601 R701 R702 = quad:R-US_: RESISTOR, American symbol
U101 = quad:STM32F427VGT6
U202 = quad:AND_GATE
U203 = quad:SN74AHC1G32DBVR
U401 = quad:FT232R
U402 = quad:USB-MICROB
U403 = quad:LD1117
U404 = quad:MFS201N-16-Z
U701 = quad:PSMN9RS-30YLC
X101 = quad:OSCILLATOR
XB1 = quad:XBEE: XBee (TM) /XBee-PRO(TM) OEM RF Modules Source: MaxStream, Inc. xbee_productmanual.pdf; MPN: XBP24-Z7UIT-004; OC_FARNELL: 1751799; OC_NEWARK: 34R5507
Y501 = quad:CRYSTAL: CRYSTAL

## Net classes
1 diff pair: width 0.254 mm

## Board
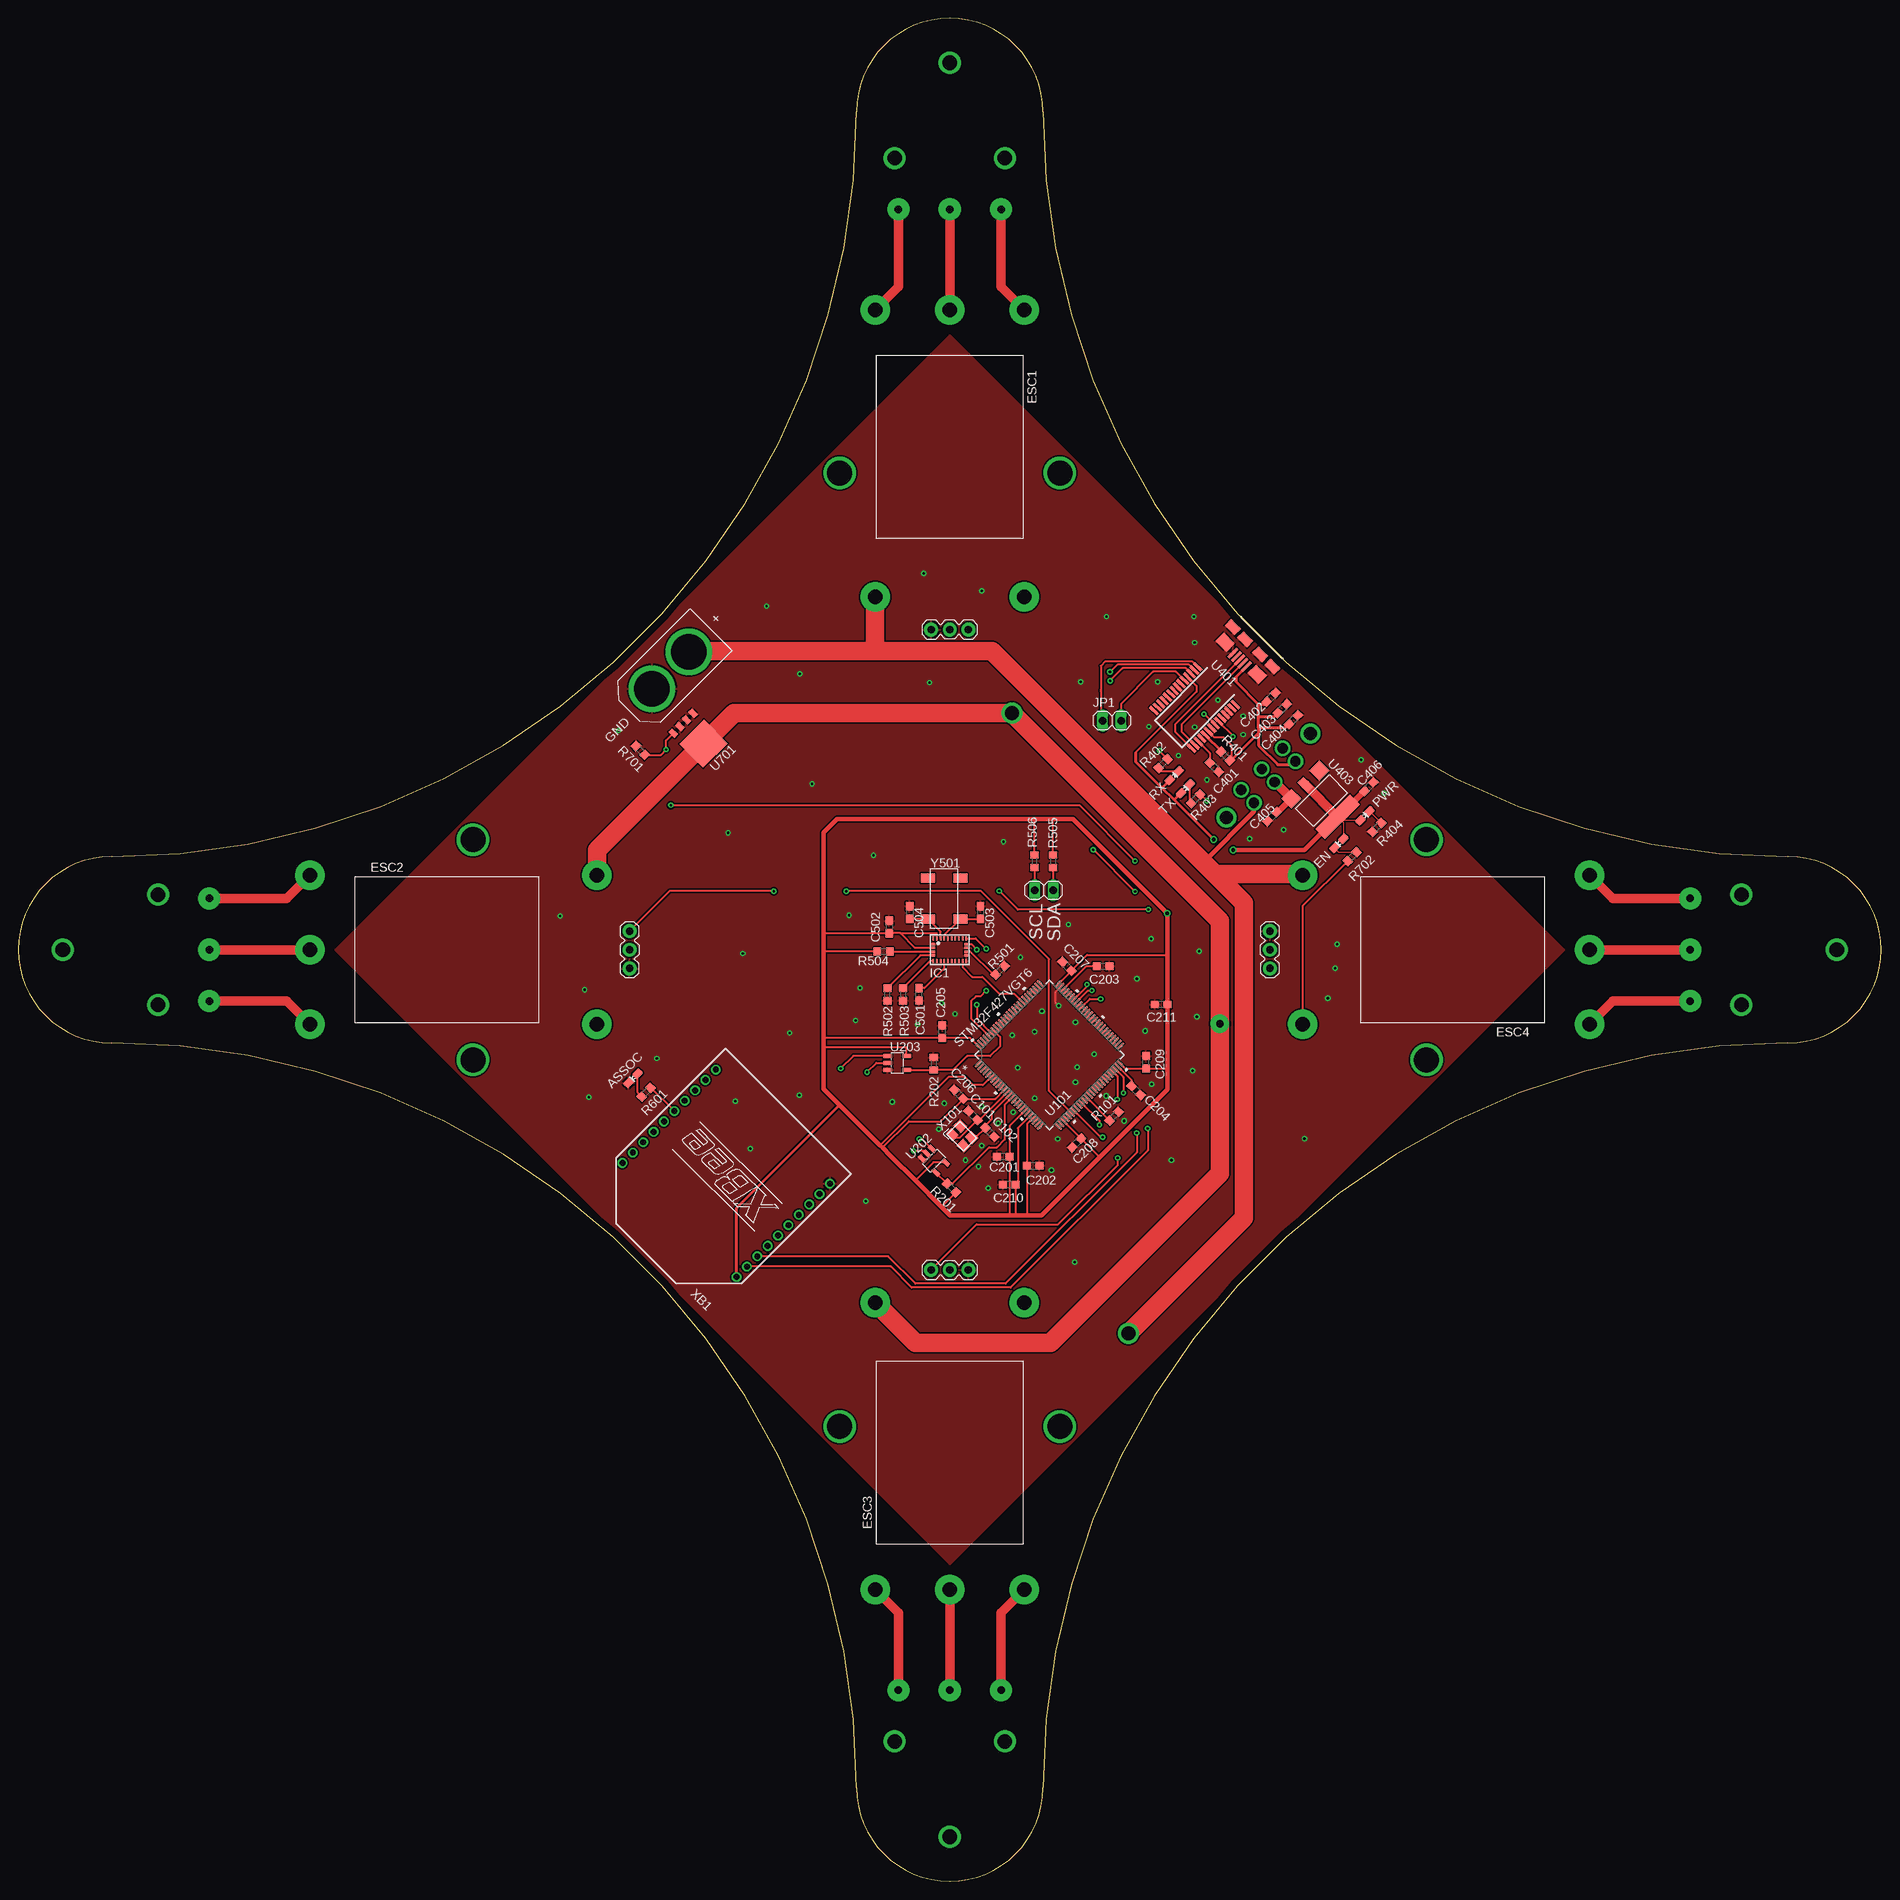
[diagram p7: board, top side]
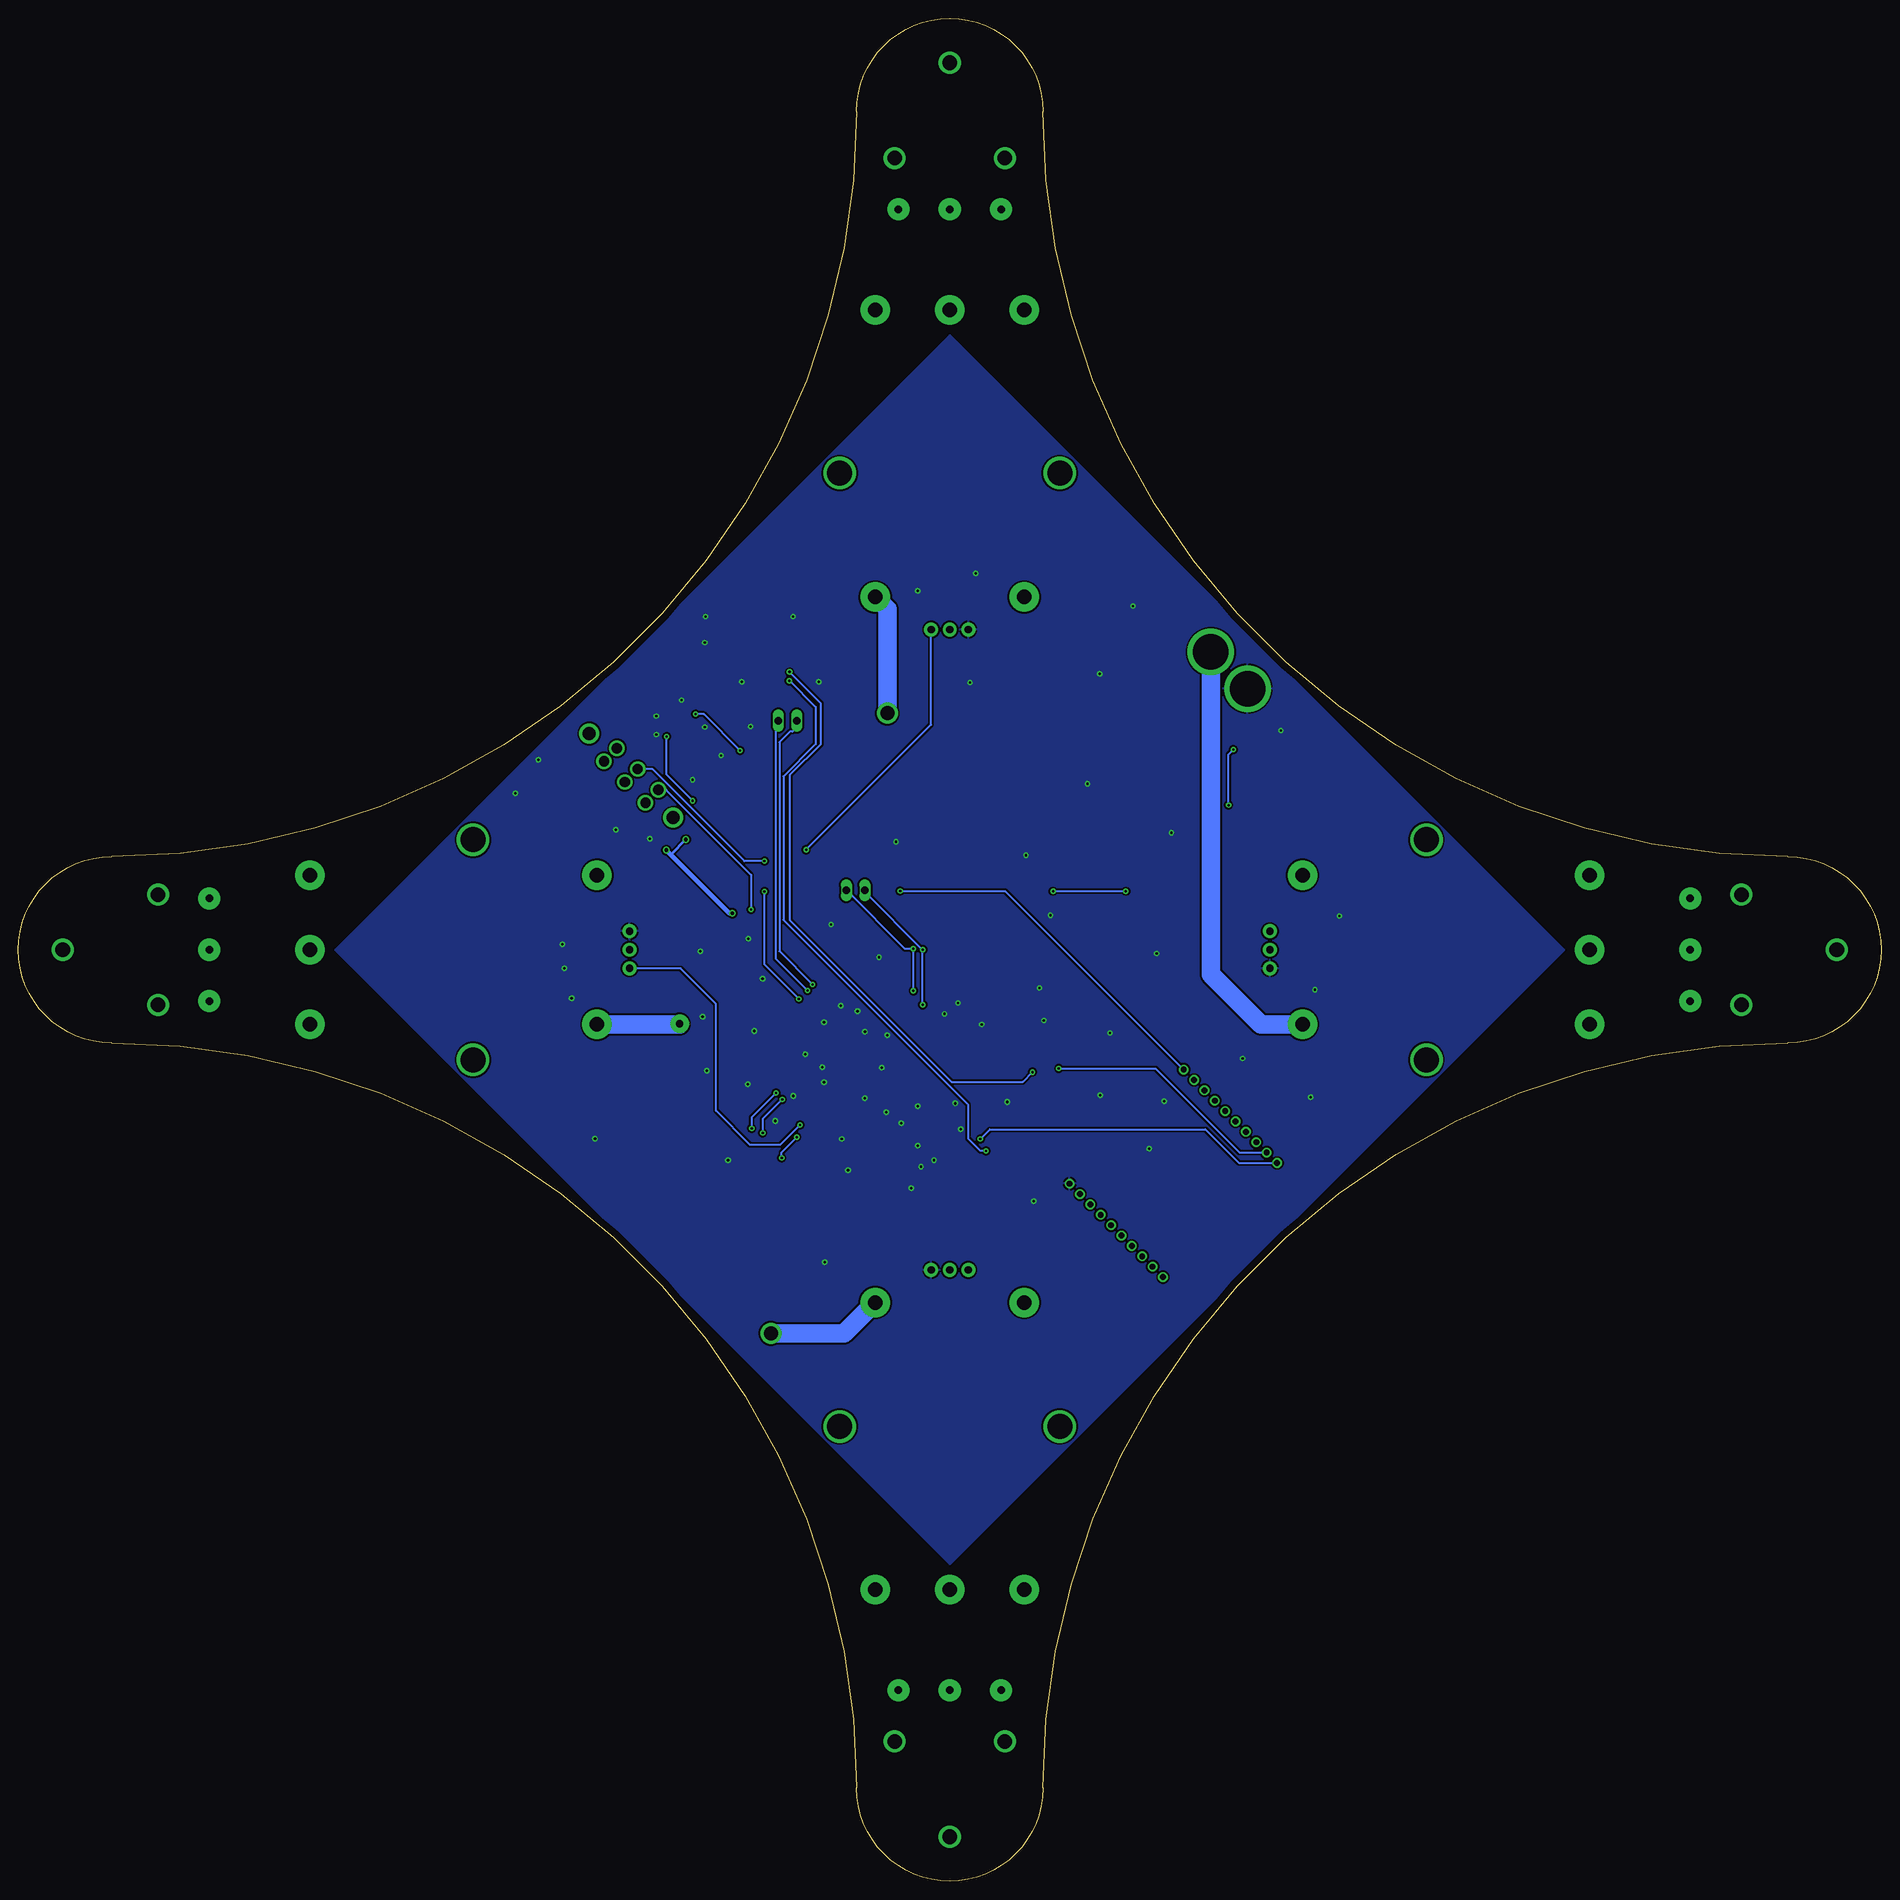
[diagram p8: board, bottom side, seen from below]

Size 254 x 254 mm. Coordinates in mm from the lower left corner, seen from the top.
Outline: 139.7,241.3 arc180 114.3,241.3 arc-90 12.7,139.7 arc180 12.7,114.3 arc-90 114.3,12.7 arc180 139.7,12.7 arc-90 241.3,114.3 arc180 241.3,139.7 arc-90 139.7,241.3
Copper layers (1*16): Top 0.035mm / dielectric 1.5mm / Bottom 0.035mm
Design rules "PCBway": minimum track width 6mil, minimum drill 0.3mm, track to track 0.205mm, track to pad 0.205mm, pad to pad 0.205mm, via to via 0.205mm, smd to smd 8mil, copper to edge 40mil, drill to drill 8mil, minimum pad ring 10mil, minimum via ring 8mil, stop-mask expansion 4mil, vias tented up to drill 25mil, thermal gap 10mil

### Footprints (pad centres in the part's own frame; a part is rotated, then mirrored left to right if it is on the bottom)
LED-0603 = smd 1.016 x 1.27: A 0,-0.877; C 0,0.877
C0603 = smd 1.1 x 1: 1 -0.85,0; 2 0.85,0
AFRO_ESC = drill 2 pad 4: GND -10.16,20.48; MOT1 -10.16,-18.655; MOT2 0,-18.655; MOT3 10.16,-18.655; VBATT 10.16,20.48 | drill 1.016 pad 1.88: P$3 0,24.925; PWM -2.54,24.925; PWM_GND 2.54,24.925
LGA-28_3.80X5.20/0.5 = smd 0.25 x 0.5: 1 -2.25,1.56; 6 -2.25,-1.56; 7 -1.75,-1.56; 8 -1.25,-1.56; 9 -0.75,-1.56; 10 -0.25,-1.56; 11 0.25,-1.56; 12 0.75,-1.56; 13 1.25,-1.56; 14 1.75,-1.56; 15 2.25,-1.56; 20 2.25,1.56; 21 1.75,1.56; 22 1.25,1.56; 23 0.75,1.56; 24 0.25,1.56; 25 -0.25,1.56; 26 -0.75,1.56; 27 -1.25,1.56; 28 -1.75,1.56 | smd 0.5 x 0.25: 2 -2.25,0.75; 3 -2.25,0.25; 4 -2.25,-0.25; 5 -2.25,-0.75; 16 2.25,-0.75; 17 2.25,-0.25; 18 2.25,0.25; 19 2.25,0.75
1X02 = drill 1.016 long: 1 -1.27,0; 2 1.27,0
XT60 = drill 4.826 pad 6.35: GND 0,-3.531; PWR 0,3.531
MOTOR = drill 1 pad 3: MOT1 7,-7; MOT2 0,-7; MOT3 -7,-7 | drill 2: P$1 -7.5,0; P$2 7.5,0; P$3 0,12.99
R0603 = smd 1 x 1.1: 1 -0.85,0; 2 0.85,0
LQFP-100 = smd 1.2 x 0.25: 1 -7.722,6; 2 -7.722,5.5; 3 -7.722,5; 4 -7.722,4.5; 5 -7.722,4; 6 -7.722,3.5; 7 -7.722,3; 8 -7.722,2.5; 9 -7.722,2; 10 -7.722,1.5; 11 -7.722,1; 12 -7.722,0.5; 13 -7.722,0; 14 -7.722,-0.5; 15 -7.722,-1; 16 -7.722,-1.5; 17 -7.722,-2; 18 -7.722,-2.5; 19 -7.722,-3; 20 -7.722,-3.5; 21 -7.722,-4; 22 -7.722,-4.5; 23 -7.722,-5; 24 -7.722,-5.5; 25 -7.722,-6; 51 7.722,-6; 52 7.722,-5.5; 53 7.722,-5; 54 7.722,-4.5; 55 7.722,-4; 56 7.722,-3.5; 57 7.722,-3; 58 7.722,-2.5; 59 7.722,-2; 60 7.722,-1.5; 61 7.722,-1; 62 7.722,-0.5; 63 7.722,0; 64 7.722,0.5; 65 7.722,1; 66 7.722,1.5; 67 7.722,2; 68 7.722,2.5; 69 7.722,3; 70 7.722,3.5; 71 7.722,4; 72 7.722,4.5; 73 7.722,5; 74 7.722,5.5; 75 7.722,6 | smd 0.25 x 1.2: 26 -6,-7.722; 27 -5.5,-7.722; 28 -5,-7.722; 29 -4.5,-7.722; 30 -4,-7.722; 31 -3.5,-7.722; 32 -3,-7.722; 33 -2.5,-7.722; 34 -2,-7.722; 35 -1.5,-7.722; 36 -1,-7.722; 37 -0.5,-7.722; 38 0,-7.722; 39 0.5,-7.722; 40 1,-7.722; 41 1.5,-7.722; 42 2,-7.722; 43 2.5,-7.722; 44 3,-7.722; 45 3.5,-7.722; 46 4,-7.722; 47 4.5,-7.722; 48 5,-7.722; 49 5.5,-7.722; 50 6,-7.722; 76 6,7.722; 77 5.5,7.722; 78 5,7.722; 79 4.5,7.722; 80 4,7.722; 81 3.5,7.722; 82 3,7.722; 83 2.5,7.722; 84 2,7.722; 85 1.5,7.722; 86 1,7.722; 87 0.5,7.722; 88 0,7.722; 89 -0.5,7.722; 90 -1,7.722; 91 -1.5,7.722; 92 -2,7.722; 93 -2.5,7.722; 94 -3,7.722; 95 -3.5,7.722; 96 -4,7.722; 97 -4.5,7.722; 98 -5,7.722; 99 -5.5,7.722; 100 -6,7.722
SOT23-5L = smd 0.55 x 1.2: 1 -0.95,-1.3; 2 0,-1.3; 3 0.95,-1.3; 4 0.95,1.3; 5 -0.95,1.3
SSOP28 = smd 0.4 x 1.5: 1 -4.225,-3.625; 2 -3.575,-3.625; 3 -2.925,-3.625; 4 -2.275,-3.625; 5 -1.625,-3.625; 6 -0.975,-3.625; 7 -0.325,-3.625; 8 0.325,-3.625; 9 0.975,-3.625; 10 1.625,-3.625; 11 2.275,-3.625; 12 2.925,-3.625; 13 3.575,-3.625; 14 4.225,-3.625; 15 4.225,3.625; 16 3.575,3.625; 17 2.925,3.625; 18 2.275,3.625; 19 1.625,3.625; 20 0.975,3.625; 21 0.325,3.625; 22 -0.325,3.625; 23 -0.975,3.625; 24 -1.625,3.625; 25 -2.275,3.625; 26 -2.925,3.625; 27 -3.575,3.625; 28 -4.225,3.625
USB-B-MICRO-SMD = smd 0.4 x 1.75: D+ 0,2.825; D- -0.65,2.825; GND 1.3,2.825; ID 0.65,2.825; VBUS -1.3,2.825 | smd 2.1 x 1.6: SHIELD1 3.1,2.55; SHIELD2 -3.1,2.55 | smd 1.9 x 1.2: SHIELD3 -3.8,0.35; SHIELD4 -1.45,0.35; SHIELD5 1.45,0.35; SHIELD6 3.8,0.35
SOT223 = smd 1.9 x 1.9: 1 -2.7,-3.1; 3 2.7,-3.1 | smd 1.1 x 1.9: 2 0,-3.1 | smd 6.7 x 1.9: 4 0,3.1
MFS201N-16-Z = drill 1.4: 1 -4,-1.25; 2 0,-1.25; 3 4,-1.25; 4 -4,1.25; 5 0,1.25; 6 4,1.25 | drill 1.8: P$7 -8.1,0; P$8 8.1,0
SOT669 = smd 0.7 x 1.15: 1 -1.905,-2.725; 2 -0.635,-2.725; 3 0.635,-2.725; 4 1.905,-2.725 | smd 4.7 x 4.6: MB 0,1.2
OSC3.2X2.5 = smd 1.4 x 1.2: 1 -1.1,-0.8; 2 1.1,-0.8; 3 1.1,0.8; 4 -1.1,0.8
XBEE = drill 0.8 pad 1.27: 1 -11,9; 2 -11,7; 3 -11,5; 4 -11,3; 5 -11,1; 6 -11,-1; 7 -11,-3; 8 -11,-5; 9 -11,-7; 10 -11,-9; 11 11,-9; 12 11,-7; 13 11,-5; 14 11,-3; 15 11,-1; 16 11,1; 17 11,3; 18 11,5; 19 11,7; 20 11,9
ABS25 = smd 1.27 x 1.905: 1 -2.794,-2.223; 2 2.794,-2.223; 3 2.794,2.223; 4 -2.794,2.223

### Placement (x,y rotation side)
ASSOC  83.82,109.47 135 top
C101  130.18,104.39 315 top
C102  132.46,102.11 315 top
C201  134.32,98.78 180 top
C202  138.4,97.56 0 top
C203  147.9,124.76 0 top
C204  152.4,107.82 315 top
C205  125.98,115.82 90 top
C206  128.24,107.29 135 top
C207  142.98,124.74 135 top
C208  144.3,100.66 225 top
C209  153.77,111.66 90 top
C210  135.13,94.97 180 top
C211  155.83,119.53 180 top
C401  163.07,151.89 315 top
C402  170.81,161.42 225 top
C403  172.34,159.89 45 top
C404  173.86,158.37 45 top
C405  170.94,145.16 225 top
C406  184.15,149.22 45 top
C501  122.81,120.9 90 top
C502  118.75,130.1 270 top
C503  131.19,132.08 270 top
C504  121.54,132.08 270 top
EN  180.06,141.5 135 top
ESC1  127,195.58 180 top
ESC2  58.42,127 270 top
ESC3  127,58.42 0 top
ESC4  195.58,127 90 top
IC1  127,127 0 top
J501  139.83,135.13 180 top
J701  88.9,165.1 315 top
JP1  149.1,158.24 0 top
MOT1  127,234.95 0 top
MOT2  19.05,127 90 top
MOT3  127,19.05 180 top
MOT4  234.95,127 270 top
PWR  183.62,145.29 315 top
R101  149.4,104.32 45 top
R201  127.23,94.51 315 top
R202  124.82,111.46 90 top
R401  164.59,153.42 315 top
R402  156.08,152.4 225 top
R403  160.53,147.57 225 top
R404  185.24,143.69 45 top
R501  133.86,124.21 45 top
R502  118.49,120.9 270 top
R503  120.65,120.9 270 top
R504  117.98,126.75 180 top
R505  141.1,139.06 270 top
R506  138.56,139.06 270 top
R601  85.6,107.57 45 top
R701  84.81,154.18 315 top
R702  181.86,139.7 45 top
RX  157.61,150.75 315 top
TX  159.13,148.97 315 top
U101  140.59,112.65 45 top
U202  124.84,98.25 225 top
U203  119.84,111.58 270 top
U401  160.4,160.02 225 top
U402  168.53,168.53 135 top
U403  177.67,147.32 225 top
U404  170.43,150.75 45 top
U701  92.58,155.96 225 top
X101  128.65,101.6 315 top
XB1  96.52,96.52 135 top
Y501  126.24,133.99 90 top

### Tracks (layer width: path | path; a pad name or v marks a point on that pad's centre or on a via)
BOOT0
  Top 0.254: U101.94 133.86,115.14 133.86,113.84 132.51,112.5 129.36,112.5 127.47,110.61 R202.1 124.79,110.63 U203.4
BOOT1
  Top 0.305: U101.37 R101.1
FT232_DTR  (via drill 0.3, 0.35)
  Top 0.254: U401.2 159.62,165.86 149.84,165.86 v148.84,164.87 | v115.72,110.31 116.99,111.58 U203.2
  Bottom 0.254: v115.72,110.31 117.04,108.99 126.75,108.99 148.74,130.99 148.74,150.88 144.55,155.07 144.55,160.58 v148.84,164.87
FT232_RTS  (via drill 0.3, 0.35)
  Top 0.254: U401.3 159.18,165.38 150.57,165.38 v148.87,163.68 | U202.2 123.52,99.57 v122.07,99.57
  Bottom 0.254: 122.78,99.57 124.51,101.3 124.51,105.89 149.68,131.06 149.68,150.65 145.29,155.04 145.29,160.1 v148.87,163.68
  Bottom 0.305: v122.07,99.57 122.78,99.57
GND  (via drill 0.3, 0.35)
  Top 0.254: U101.74 141.35,121.19 141.35,119.89 v141.86,119.38
  other vias: 179.83,127.76 179.58,124.46 178.56,120.4 146.69,112.78 144.4,111 144.15,108.97 136.27,110.92 138.56,115.82 135.51,115.32 139.57,118.62 144.15,117.09 141.73,101.22 138.58,106.76 160.4,157.35 163.58,161.04 167,158.88 167,156.34 129.16,98.3 130.94,97.41 114.76,121.79 143.21,130.43 136.63,125.98 125.88,119.76 105.16,115.65 127.71,118.26 122.63,116.81 153.67,115.93 152.53,123.04 154.46,128.52 161.01,126.82 160.71,117.88 160.12,110.49 157.23,98.32 144.04,84.38 175.36,101.22 98.78,126.49 87.07,112.17 96.77,142.95 73.86,131.6 77.19,121.54 108.23,149.63 102.01,173.86 81.84,156.87 131.37,175.95 148.39,172.42 160.3,172.42 160.4,168.88 172.54,143.33 167.89,142.11 155.35,163.53 154.15,157.43 144.86,163.53 158.19,153.47 162.05,150.16 186.26,148.31 183.11,152.91 154.56,108.69 150.77,103.66 148.36,107.06 126.24,106.05 119.15,106.25 114.17,117.37 113.26,131.7 125.48,102.54 131.37,105.66 131.34,100.28 133.6,103.33 115.57,92.71 106.48,107.14 77.77,106.88 116.59,139.88 134.34,141.73 106.55,164.62 124.23,163.45 99.8,99.9 97.76,106.35 123.47,178.33 135.66,104.88 140.87,96.93 132.23,94.51
  pour Top (rank 6): 127,210.82 43.18,127 127,43.18 210.82,127
  pour Bottom (isolate 0.254, rank 6): 127,210.82 210.82,127 127,43.18 43.18,127
I2C1_SCL  (via drill 0.35)
  Top 0.254: IC1.19 129.93,127.75 v130.68,127 | v130.68,119.51 130.68,117.61 U101.95 | R506.2 J501.2
  Bottom 0.254: v130.68,119.51 v130.68,127 138.56,134.87 J501.2
I2C1_SDA  (via drill 0.35)
  Top 0.254: IC1.20 130.52,128.56 v131.95,127.13 | v131.95,121.41 131.19,120.65 130.56,120.65 129.92,120.02 129.92,117.66 U101.96 | R505.2 J501.1
  Bottom 0.254: v131.95,121.41 v131.95,127.13 133.1,127.13 J501.1
JTCK-SWCLK
  Top 0.254: U101.76 139.32,122.4
KILL_GND  (via drill 1 pad 2.54, 1.91 pad 2.54)
  Top 0.305: R702.1 175.1,132.94 ESC4.GND
  Top 2.54: ESC3.GND 122.33,73.41 140.72,73.41 163.83,96.52 v163.83,116.89 163.83,130.94 v135.51,159.26 97.58,159.26 U701.MB 78.9,140.58 ESC2.GND
  Bottom 2.54: ESC1.GND 135.51,173.45 v135.51,159.26 | ESC4.GND 163.83,116.84 v163.83,116.89
MOT1_1
  Top 1.27: ESC1.MOT1 134,217.39 MOT1.MOT1
MOT1_2
  Top 1.27: ESC1.MOT2 MOT1.MOT2
MOT1_3
  Top 1.27: ESC1.MOT3 120,217.39 MOT1.MOT3
MOT2_1
  Top 1.27: ESC2.MOT1 36.61,134 MOT2.MOT1
MOT_2_2
  Top 1.27: MOT2.MOT2 ESC2.MOT2
MOT_2_3
  Top 1.27: ESC2.MOT3 36.61,120 MOT2.MOT3
MOT_3_1
  Top 1.27: ESC3.MOT1 120,36.61 MOT3.MOT1
MOT_3_2
  Top 1.27: ESC3.MOT2 MOT3.MOT2
MOT_3_3
  Top 1.27: ESC3.MOT3 134,36.61 MOT3.MOT3
MOT_4_1
  Top 1.27: ESC4.MOT1 217.39,120 MOT4.MOT1
MOT_4_2
  Top 1.27: ESC4.MOT2 MOT4.MOT2
MOT_4_3
  Top 1.27: ESC4.MOT3 217.39,134 MOT4.MOT3
N$2
  Top 0.406: R401.1 163.99,154.13 U401.19
N$3
  Top 0.254: R601.1 84.44,107.53 ASSOC.A
N$4
  Top 0.254: IC1.9 126.25,124.47 123.53,121.75 C501.2
N$5
  Top 0.305: U401.17 162.47,153.82 C401.1
N$6
  Top 0.254: IC1.27 125.75,129.46 Y501.4 121.58,131.19 C504.2
N$7
  Top 0.254: IC1.26 126.25,128.98 Y501.1 131.15,131.19 C503.2
N$8  (via drill 0.3)
  Top 0.305: R403.1 161.2,148.18 v162.05,147.32 | v165.61,156.08 165.61,156.19 U401.23
  Bottom 0.305: v162.05,147.32 165.61,150.88 v165.61,156.08
N$9  (via drill 0.3)
  Top 0.305: R402.1 155.57,154.11 v155.57,154.18 | v161.67,159.13 161.75,159.13 U401.22
  Bottom 0.305: v155.57,154.18 160.53,159.13 v161.67,159.13
N$10
  Top 0.254: R402.2 155.91,151.37 RX.C
N$11
  Top 0.254: R403.2 159.75,147.15 TX.C
N$12
  Top 0.254: R501.1 132.94,123.61 129.79,126.75 IC1.17
N$13  (via drill 3.4)
  other vias: 112,62
N$14
  Top 0.254: IC1.6 124.34,125.44 R503.1
N$15
  Top 0.254: IC1.5 122.99,126.25 R502.1
N$16
  Top 0.254: R504.1 IC1.4
N$17
  Top 0.254: XB1.15 86.28,108.17 R601.2
N$18
  Top 0.152: PWR.C 185.84,144.3 R404.2
N$19
  Top 0.152: EN.C 180.02,140.3 R702.2
N$20  (via drill 3.4)
  other vias: 142,62
N$21  (via drill 3.4)
  other vias: 62,142
N$22  (via drill 3.4)
  other vias: 62,112
N$23  (via drill 3.4)
  other vias: 192,142
N$24  (via drill 3.4)
  other vias: 192,112
N$25  (via drill 3.4)
  other vias: 142,192
N$26  (via drill 3.4)
  other vias: 112,192
NRST
  Top 0.254: U101.14 134.47,105.82 134.47,101.12 133.43,100.08 132.36,100.08 127.4,95.11 R201.1 U202.4
OSC_IN
  Top 0.254: X101.1 127.31,101.67 127.64,101.35 128.33,101.35 C101.2 131.03,103.79 U101.12
OSC_OUT
  Top 0.254: U101.13 132.72,104.78 132.72,103.89 131.86,103.03 C102.1 130.54,101.39 X101.3
PD2
  Top 0.254: IC1.14 128.75,124.61 130.05,123.32 131.44,123.32 133.73,121.03 135.74,121.03 U101.83
POWER_EN  (via drill 0.3)
  Top 0.254: v88.98,146.71 144.65,146.71 v152.27,139.09 | U701.4 88.32,155.54 v88.32,154.28 87.61,153.58 R701.2
  Bottom 0.254: U404.5 167.53,151.63 154.99,139.09 v152.27,139.09 | v88.98,146.71 88.98,153.62 v88.32,154.28
PWR
  Top 0.813: C405.1 171.73,145.76 U403.3
  Top 1.27: U404.2 173.57,147.61 U403.3
TIM3_CH1  (via drill 0.3)
  Top 0.254: v112.9,134.98 131.29,134.98 140.54,125.73 140.54,107.75 U101.31 | v103,134.98 88.78,134.98 ESC2.PWM
  Bottom 0.254: v112.9,134.98 v103,134.98
TIM3_CH2  (via drill 0.3)
  Top 0.254: ESC3.PWM 130.68,89.56 141.78,89.56 149.91,97.69 v149.91,98.63 | v147.85,101.45 147.55,101.45 U101.32
  Bottom 0.254: v149.91,98.63 149.91,99.39 v147.85,101.45
TIM3_CH3  (via drill 0.3)
  Top 0.254: U101.35 147.4,103.72 v147.4,103.12
  Bottom 0.254: v147.4,103.12 150.11,100.41 154.23,100.41 158.88,105.05 158.88,119.63 163.7,124.46 ESC4.PWM
TIM3_CH4  (via drill 0.3, 0.35)
  Top 0.254: U101.66 146.11,120.29 v147.57,120.29 | v152.27,134.95 v146.58,140.64
  Bottom 0.254: v147.57,120.29 152.27,124.99 v152.27,134.95 | v146.58,140.64 129.54,157.68 ESC1.PWM
USART1_RX  (via drill 0.3)
  Top 0.254: U401.1 160.05,166.34 148.26,166.34 147.6,165.68 147.6,162.43 | U101.69 145.72,122.02 v145.72,122.28 | 147.6,162.43 147.6,162.25 | 147.6,162.43 147.6,158.47 JP1.1
  Bottom 0.254: v145.72,122.28 150.24,126.8 150.24,155.3 148.79,156.74 148.44,156.74 147.83,157.35 JP1.1
USART1_TX  (via drill 0.3)
  Top 0.254: U401.5 157.82,164.9 154.74,164.9 150.37,160.53 JP1.2 | U101.68 145.84,121.44 v146.38,121.44
  Bottom 0.254: v146.38,121.44 150.75,125.81 150.75,157.86 JP1.2
USART3_RX  (via drill 0.3)
  Top 0.254: U101.48 150.67,109.64 v150.67,107.49 | v154,102.64 154,99.64 135.31,80.95 121.82,80.95 118.98,83.79 XB1.2
  Bottom 0.254: v150.67,107.49 154,104.16 v154,102.64
USART3_TX  (via drill 0.3)
  Top 0.254: U101.47 149.84,109.77 v149.84,106.58 | v152.5,102.03 152.5,99.36 134.62,81.48 122.33,81.48 118.6,85.21 XB1.3
  Bottom 0.254: v149.84,106.58 152.5,103.91 v152.5,102.03
USB_D_N
  Top 0.254: U402.D- 158.62,157.7 158.62,156.74 U401.16
USB_D_P
  Top 0.254: U402.D+ 157.73,157.73 157.73,156.72 U401.15
VBATT  (via drill 1.91 pad 2.54)
  Top 0.61: U404.1 168.49,145.83 161.57,138.91
  Top 2.54: 116.84,167.75 132.73,167.75 161.57,138.91 163.18,137.3 | 163.18,137.3 167.13,133.35 167.13,90.42 v151.38,74.68 | ESC1.VBATT 116.84,167.75 | ESC4.VBATT 174.96,137.3 163.18,137.3 | J701.PWR 91.55,167.75 116.84,167.75
  Bottom 2.54: v151.38,74.68 141.38,74.68 ESC3.VBATT | ESC2.VBATT 84.58,116.84 91.4,123.66 J701.PWR
VBUS
  Top 0.305: R401.2 165.29,152.91 165.48,153.1 165.48,154.81 164.34,155.96 163.09,155.96 U401.20
  Top 0.406: U402.VBUS 165.99,164.15 165.99,163.58 169.1,160.47 169.1,160.4 | R401.2 165.29,152.91 165.48,152.91 169.1,156.53 | 169.1,158.75 169.1,160.4 | 169.1,157.23 169.1,158.75 | 169.1,157.23 169.1,156.53 | C402.2 169.8,160.4 169.1,160.4 | C403.1 171.2,158.75 169.1,158.75 | C404.1 172.72,157.23 169.1,157.23 | 169.1,156.53 169.1,154.85 171.73,152.22 173.68,152.22 U404.3
VCAP2
  Top 0.254: U101.73 145.63,124.77 C203.1
VCAP_1
  Top 0.254: U101.49 151.8,109.22 C204.1
VDD_3V3  (via drill 0.5 pad 0.85)
  Top 0.152: PWR.A 180.32,144.67 U403.4 180.68,144.31 EN.A
  Top 0.254: 150.29,111.45 U101.50 150.31,111.42 | 156.99,149.88 RX.A | U101.19 135.16,102.98 C201.1 135.16,90.78 135.13,90.78 | U101.22 137.56,103.25 C202.1 137.56,90.78 137.57,90.78 | U101.21 136.3,102.7 136.3,95.29 C210.1 135.98,90.84 136.04,90.78 | U101.28 C208.1 147.26,98.9 147.26,98.51 | R506.1 138.56,144.83 138.53,144.83 | R505.1 141.1,144.83 141.02,144.83 | R504.2 109.8,126.75 109.8,126.77 | IC1.28 125.25,129.26 120.27,129.26 | 120.27,129.26 118.75,129.26 C502.2 109.8,129.25 109.8,129.31 | IC1.3 122.28,127.25 120.27,129.26 | U101.100 129.78,114.97 C205.1 109.8,114.97 109.8,114.94 | U203.5 121.14,113.66 109.8,113.66 | U101.75 143.58,124.12 C207.1 145.73,126.29 156.68,126.29 | 119.06,98.91 118.92,98.91 | 129.95,90.83 129.9,90.78 | R201.2 125.88,91.97 125.88,91.95 | 117.82,100.01 117.84,100.01 121.44,103.61 125.76,103.61 C206.1 133.21,106.69 U101.11 | U101.6 131.52,108.53 130.18,108.53 129.08,109.63 126.8,109.63 117.5,100.33
  Top 0.305: U401.4 160.66,162.98 160.66,162.18 152.35,153.87 | U101.50 150.91,110.81 C209.1 153.78,110.8 156.67,110.8 | 156.65,110.81 156.67,110.8 | 156.67,110.8 156.68,110.81 | 156.68,119.18 C211.1 | U202.5 124.77,98 122.3,95.53
  Top 0.406: 152.35,153.87 152.35,152.68 155.89,149.14 | 155.89,149.14 157.54,147.49 | 157.54,147.49 v162.99,142.04 | TX.A 157.65,147.49 157.54,147.49 | RX.A 155.99,149.14 155.89,149.14 | XB1.1 97.93,91.79 111.99,105.84
  Top 0.61: U403.4 175.33,140.59 v165.66,140.59 | 156.68,119.18 156.68,126.29 v156.68,131.94 v156.67,131.95 143.79,144.83 141.02,144.83 138.53,144.83 111.66,144.83 109.8,142.98 109.8,129.31 109.8,126.77 109.8,114.94 109.8,113.66 109.8,108.03 111.99,105.84 117.5,100.33 117.82,100.01 118.92,98.91 122.3,95.53 125.88,91.95 127.05,90.78 129.9,90.78 135.13,90.78 136.04,90.78 137.57,90.78 139.52,90.78 147.26,98.51 156.67,107.92 156.67,110.8 156.67,119.52 C211.1
  Top 0.813: C406.1 180.05,145.13 U403.4
  Top 1.27: U403.2 U403.4
  Bottom 0.406: 164.52,139.55 164.52,139.45 | v162.99,142.04 165.01,140.02 165.01,139.94
  Bottom 0.61: v165.66,140.59 165.01,139.94 164.52,139.45 157.02,131.95 v156.67,131.95
XBEE_DIO0  (via drill 0.3)
  Top 0.254: U202.1 123.21,101.22 v122.83,101.22
  Bottom 0.254: v122.83,101.22 121.54,102.51 92.15,102.51 87.57,97.93 XB1.20
XBEE_DIO1  (via drill 0.3)
  Top 0.254: U203.1 113.88,112.53 v112.14,110.8
  Bottom 0.254: v112.14,110.8 98.93,110.8 87.49,99.35 XB1.19
XBEE_DIO4  (via drill 0.3)
  Top 0.254: v154.08,132.49 136.27,132.49 v133.76,135
  Bottom 0.254: U404.4 165.67,148.8 154.08,137.21 v154.08,132.49 | XB1.11 119.44,135 v133.76,135

### Text on the board
tNames: SCL | SDA